# Altium project OpenCore_Carrier_Board.PrjPcb (part 1 of 2)
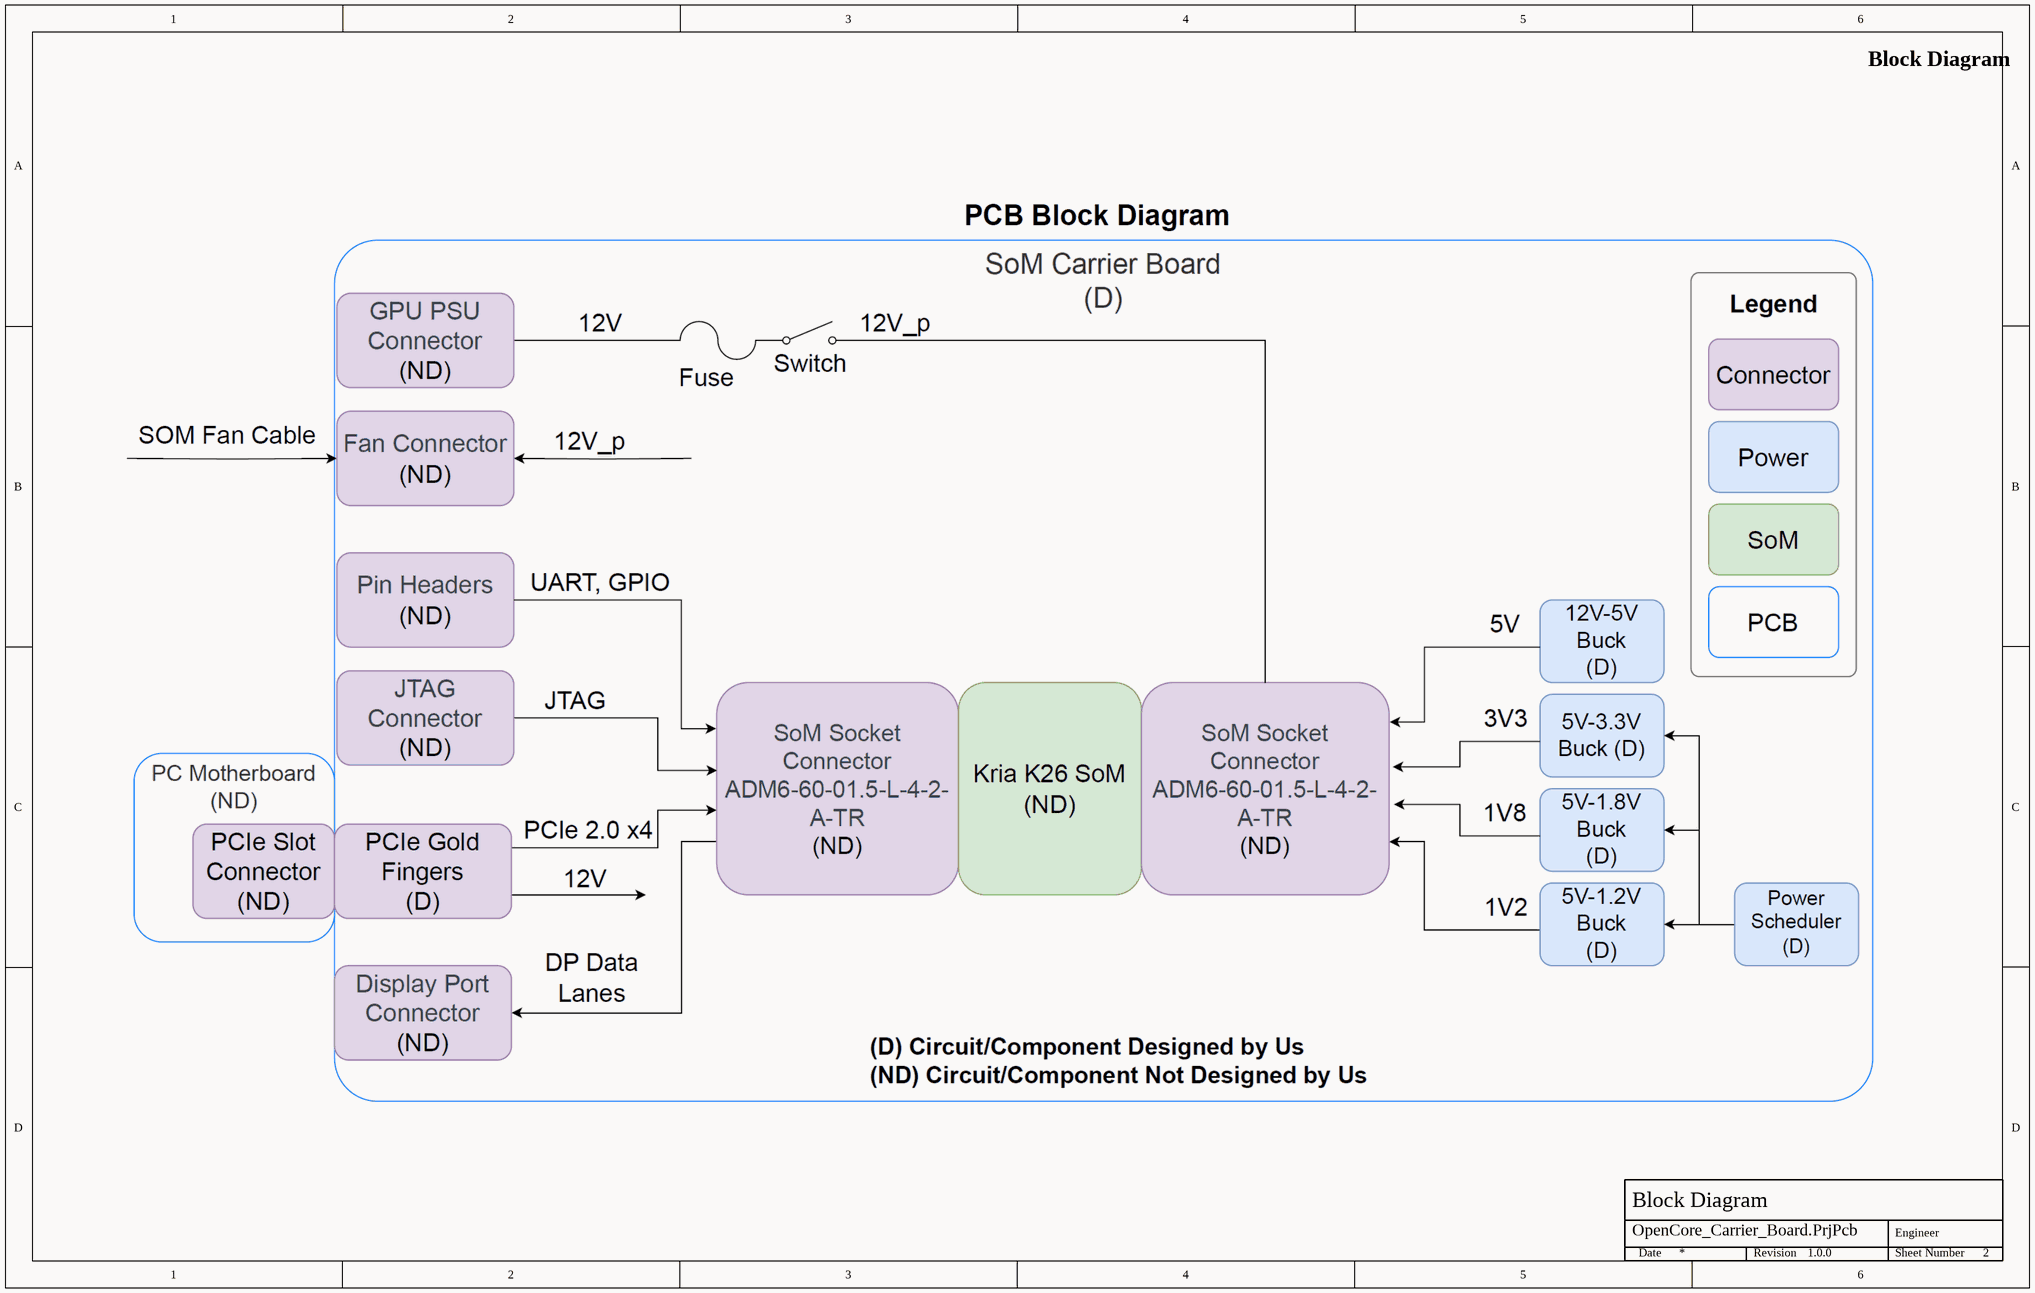
[diagram p0: S01_Block_Diagram.SchDoc]
BoardRevision: 1.0.0
12 sheets, 268 parts. Net scope: global (net labels, ports and power ports of the same name join across sheets).
Board file: OpenCore_Carrier_Board.PcbDoc
Sheets:
  S01_Block_Diagram.SchDoc
  S02_Power_Converters.SchDoc
  S03_SOM1_A_B.SchDoc
  S04_SOM1_C_D.SchDoc
  S05_SOM2_A_B.SchDoc
  S06_SOM2_C_D.SchDoc
  S07_PCIe_Connector.SchDoc
  S08_DisplayPort.SchDoc
  S09_Connectors.SchDoc
  S10_Reset_Logic.SchDoc
  S11_LEDs.SchDoc
  S12_Clocks.SchDoc

## Sheet S01_Block_Diagram.SchDoc: Block Diagram
size 381 x 241 mm; CompanyName: OpenCore; Revision: 1.0.0; SheetNumber: 2; SheetTotal: 9

### Notes on the sheet
- Engineer
- Date
- Revision
- Sheet Number

## Sheet S02_Power_Converters.SchDoc: Power Converters
size 381 x 241 mm; SheetNumber: 2; SheetTotal: 12
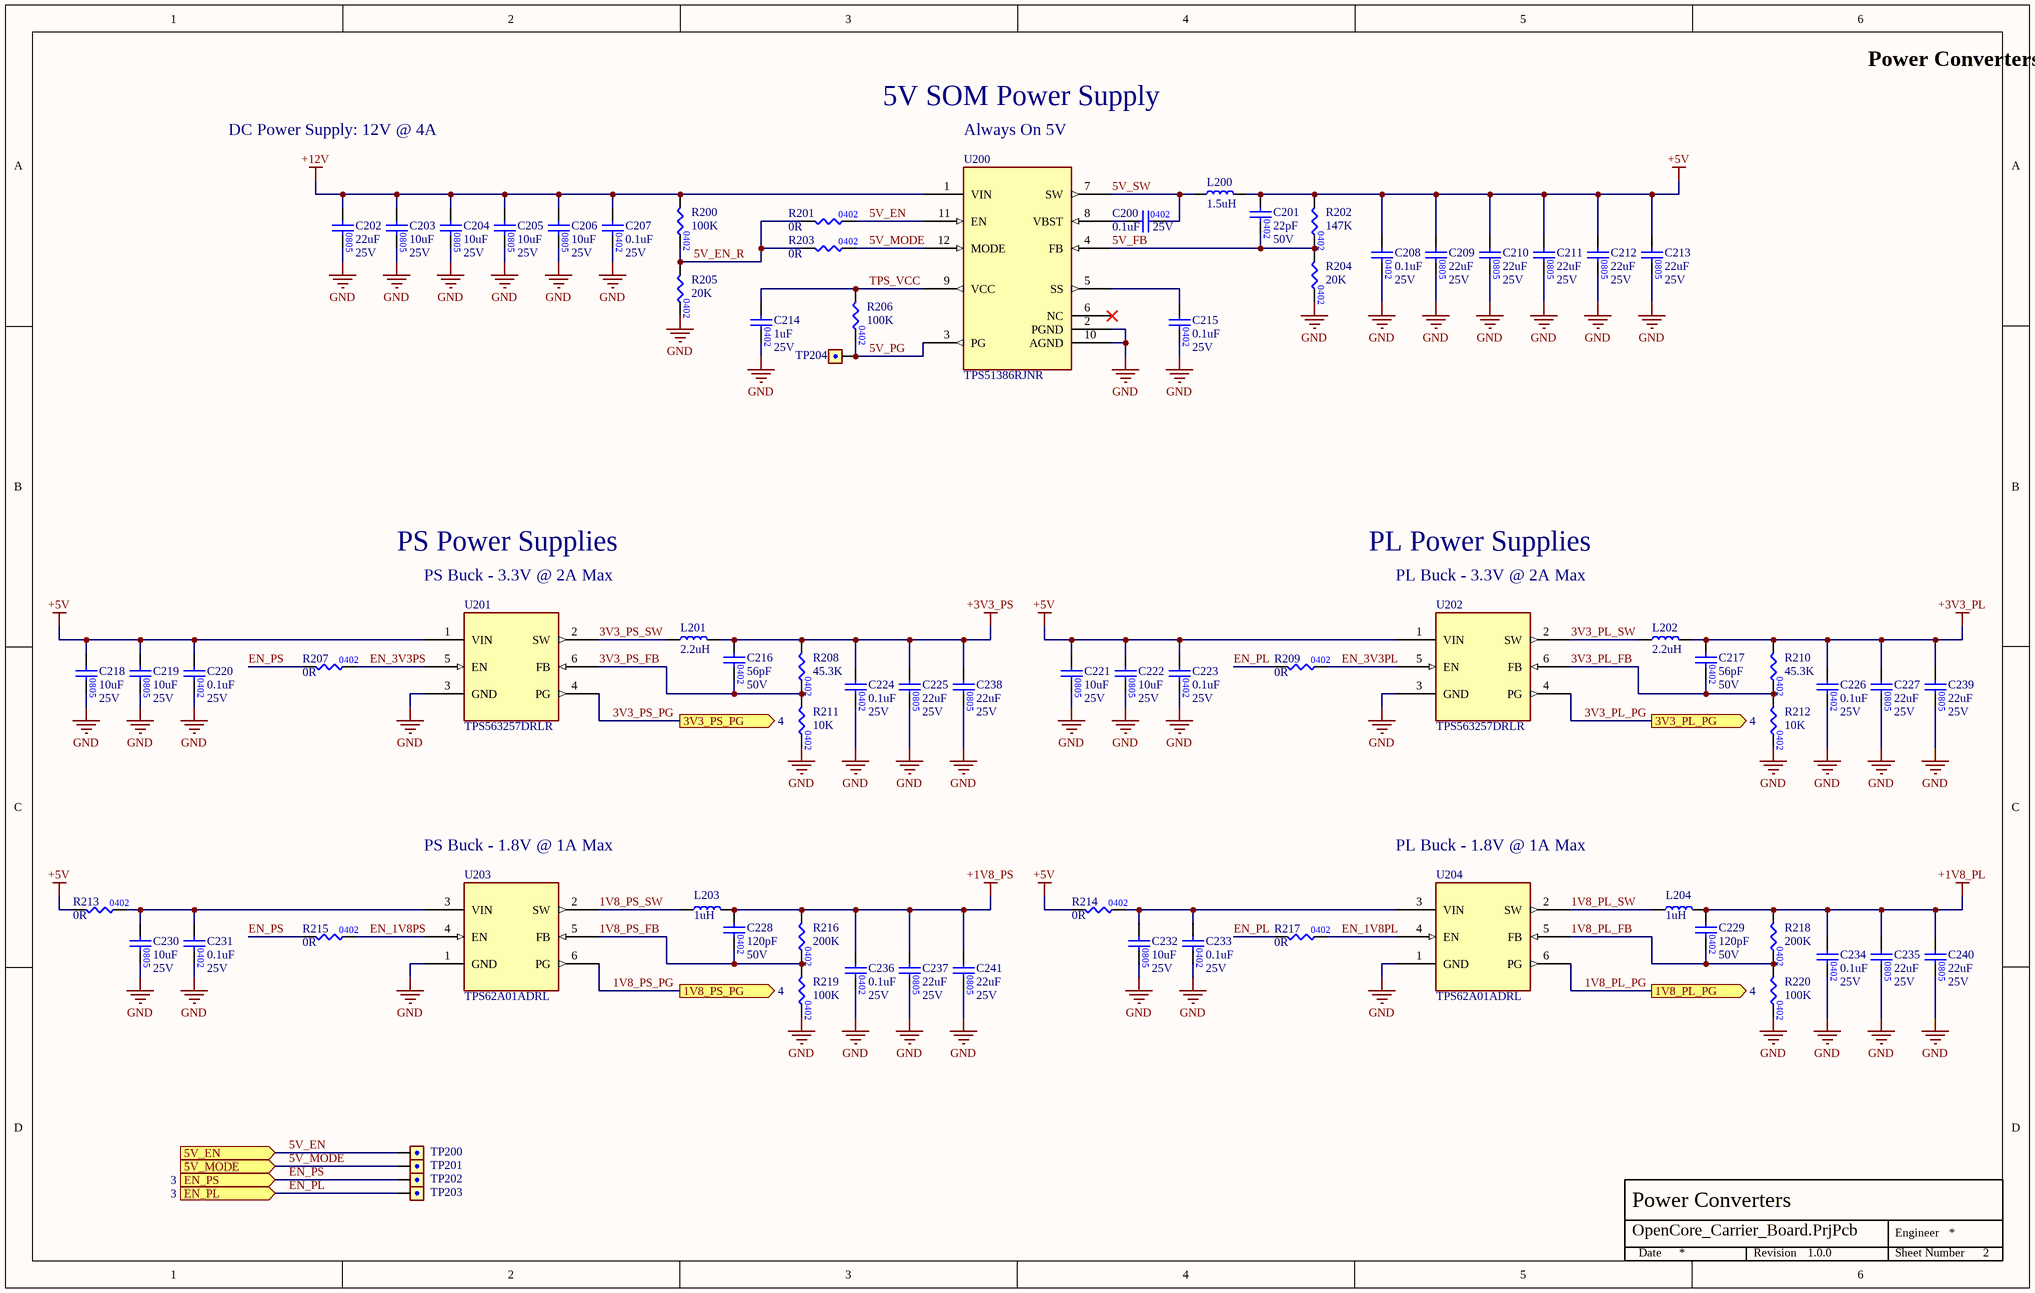
[diagram p1: S02_Power_Converters.SchDoc]

### Parts
C200  value 0.1uF  Voltage Rating: 25V  [CAP0402]  (hidden comment: CAP_0402)
C201  value 22pF  Voltage Rating: 50V  [CAP0402]  (hidden comment: CAP_0402)
C202  value 22uF  Voltage Rating: 25V  [CAP0805]  (hidden comment: CAP_0805)
C203  value 10uF  Voltage Rating: 25V  [CAP0805]  (hidden comment: CAP_0805)
C204  value 10uF  Voltage Rating: 25V  [CAP0805]  (hidden comment: CAP_0805)
C205  value 10uF  Voltage Rating: 25V  [CAP0805]  (hidden comment: CAP_0805)
C206  value 10uF  Voltage Rating: 25V  [CAP0805]  (hidden comment: CAP_0805)
C207  value 0.1uF  Voltage Rating: 25V  [CAP0402]  (hidden comment: CAP_0402)
C208  value 0.1uF  Voltage Rating: 25V  [CAP0402]  (hidden comment: CAP_0402)
C209  value 22uF  Voltage Rating: 25V  [CAP0805]  (hidden comment: CAP_0805)
C210  value 22uF  Voltage Rating: 25V  [CAP0805]  (hidden comment: CAP_0805)
C211  value 22uF  Voltage Rating: 25V  [CAP0805]  (hidden comment: CAP_0805)
C212  value 22uF  Voltage Rating: 25V  [CAP0805]  (hidden comment: CAP_0805)
C213  value 22uF  Voltage Rating: 25V  [CAP0805]  (hidden comment: CAP_0805)
C214  value 1uF  Voltage Rating: 25V  [CAP0402]  (hidden comment: CAP_0402)
C215  value 0.1uF  Voltage Rating: 25V  [CAP0402]  (hidden comment: CAP_0402)
C216  value 56pF  Voltage Rating: 50V  [CAP0402]  (hidden comment: CAP_0402)
C217  value 56pF  Voltage Rating: 50V  [CAP0402]  (hidden comment: CAP_0402)
C218  value 10uF  Voltage Rating: 25V  [CAP0805]  (hidden comment: CAP_0805)
C219  value 10uF  Voltage Rating: 25V  [CAP0805]  (hidden comment: CAP_0805)
C220  value 0.1uF  Voltage Rating: 25V  [CAP0402]  (hidden comment: CAP_0402)
C221  value 10uF  Voltage Rating: 25V  [CAP0805]  (hidden comment: CAP_0805)
C222  value 10uF  Voltage Rating: 25V  [CAP0805]  (hidden comment: CAP_0805)
C223  value 0.1uF  Voltage Rating: 25V  [CAP0402]  (hidden comment: CAP_0402)
C224  value 0.1uF  Voltage Rating: 25V  [CAP0402]  (hidden comment: CAP_0402)
C225  value 22uF  Voltage Rating: 25V  [CAP0805]  (hidden comment: CAP_0805)
C226  value 0.1uF  Voltage Rating: 25V  [CAP0402]  (hidden comment: CAP_0402)
C227  value 22uF  Voltage Rating: 25V  [CAP0805]  (hidden comment: CAP_0805)
C228  value 120pF  Voltage Rating: 50V  [CAP0402]  (hidden comment: CAP_0402)
C229  value 120pF  Voltage Rating: 50V  [CAP0402]  (hidden comment: CAP_0402)
C230  value 10uF  Voltage Rating: 25V  [CAP0805]  (hidden comment: CAP_0805)
C231  value 0.1uF  Voltage Rating: 25V  [CAP0402]  (hidden comment: CAP_0402)
C232  value 10uF  Voltage Rating: 25V  [CAP0805]  (hidden comment: CAP_0805)
C233  value 0.1uF  Voltage Rating: 25V  [CAP0402]  (hidden comment: CAP_0402)
C234  value 0.1uF  Voltage Rating: 25V  [CAP0402]  (hidden comment: CAP_0402)
C235  value 22uF  Voltage Rating: 25V  [CAP0805]  (hidden comment: CAP_0805)
C236  value 0.1uF  Voltage Rating: 25V  [CAP0402]  (hidden comment: CAP_0402)
C237  value 22uF  Voltage Rating: 25V  [CAP0805]  (hidden comment: CAP_0805)
C238  value 22uF  Voltage Rating: 25V  [CAP0805]  (hidden comment: CAP_0805)
C239  value 22uF  Voltage Rating: 25V  [CAP0805]  (hidden comment: CAP_0805)
C240  value 22uF  Voltage Rating: 25V  [CAP0805]  (hidden comment: CAP_0805)
C241  value 22uF  Voltage Rating: 25V  [CAP0805]  (hidden comment: CAP_0805)
L200  Inductance: 1.5uH  [IHLP5050CEER1R5M01]  (hidden comment: IHLP5050CEER1R5M01)
L201  Inductance: 2.2uH  [SDCHA1V6045-2R2-R]  (hidden comment: SDCHA1V6045-2R2-R)
L202  Inductance: 2.2uH  [SDCHA1V6045-2R2-R]  (hidden comment: SDCHA1V6045-2R2-R)
L203  Inductance: 1uH  [IND_2520]  (hidden comment: DFE252012F-1R0M)
L204  Inductance: 1uH  [IND_2520]  (hidden comment: DFE252012F-1R0M)
R200  Resistance: 100K  [RES0402]  (hidden comment: RES_0402)
R201  Resistance: 0R  [RES0402]  (hidden comment: RES_0402)
R202  Resistance: 147K  [RES0402]  (hidden comment: RES_0402)
R203  Resistance: 0R  [RES0402]  (hidden comment: RES_0402)
R204  Resistance: 20K  [RES0402]  (hidden comment: RES_0402)
R205  Resistance: 20K  [RES0402]  (hidden comment: RES_0402)
R206  Resistance: 100K  [RES0402]  (hidden comment: RES_0402)
R207  Resistance: 0R  [RES0402]  (hidden comment: RES_0402)
R208  Resistance: 45.3K  [RES0402]  (hidden comment: RES_0402)
R209  Resistance: 0R  [RES0402]  (hidden comment: RES_0402)
R210  Resistance: 45.3K  [RES0402]  (hidden comment: RES_0402)
R211  Resistance: 10K  [RES0402]  (hidden comment: RES_0402)
R212  Resistance: 10K  [RES0402]  (hidden comment: RES_0402)
R213  Resistance: 0R  [RES0402]  (hidden comment: RES_0402)
R214  Resistance: 0R  [RES0402]  (hidden comment: RES_0402)
R215  Resistance: 0R  [RES0402]  (hidden comment: RES_0402)
R216  Resistance: 200K  [RES0402]  (hidden comment: RES_0402)
R217  Resistance: 0R  [RES0402]  (hidden comment: RES_0402)
R218  Resistance: 200K  [RES0402]  (hidden comment: RES_0402)
R219  Resistance: 100K  [RES0402]  (hidden comment: RES_0402)
R220  Resistance: 100K  [RES0402]  (hidden comment: RES_0402)
TP200  1mm Round Pad Testpoint  [TP_1MM]  (value not drawn)
TP201  1mm Round Pad Testpoint  [TP_1MM]  (value not drawn)
TP202  1mm Round Pad Testpoint  [TP_1MM]  (value not drawn)
TP203  1mm Round Pad Testpoint  [TP_1MM]  (value not drawn)
TP204  1mm Round Pad Testpoint  [TP_1MM]  (value not drawn)
U200  TPS51386RJNR  [TI_RJN0012A_POWERVQFN12]
U201  TPS563257DRLR  [TI_SOT6_DRL0006A]
U202  TPS563257DRLR  [TI_SOT6_DRL0006A]
U203  TPS62A01ADRL  [TI_SOT6_DRL0006A]
U204  TPS62A01ADRL  [TI_SOT6_DRL0006A]

### Ports
1V8_PL_PG (out, see 4), 1V8_PS_PG (out, see 4), 3V3_PL_PG (out, see 4), 3V3_PS_PG (out, see 4), 5V_EN (in), 5V_MODE (in), EN_PL (in, see 3), EN_PS (in, see 3)

### Nets
+1V8_PL: C229.1 C234.1 C235.1 C240.1 L204.2 R218.1
+1V8_PS: C228.1 C236.1 C237.1 C241.1 L203.2 R216.1
+3V3_PL: C217.1 C226.1 C227.1 C239.1 L202.2 R210.1
+3V3_PS: C216.1 C224.1 C225.1 C238.1 L201.2 R208.1
+5V: C201.1 C208.1 C209.1 C210.1 C211.1 C212.1 C213.1 C218.1 C219.1 C220.1 C221.1 C222.1 C223.1 L200.2 R202.1 R213.1 R214.1 U201.1(VIN) U202.1(VIN)
+12V: C202.1 C203.1 C204.1 C205.1 C206.1 C207.1 R200.1 U200.1(VIN)
GND: C202.2 C203.2 C204.2 C205.2 C206.2 C207.2 C208.2 C209.2 C210.2 C211.2 C212.2 C213.2 C214.2 C215.2 C218.2 C219.2 C220.2 C221.2 C222.2 C223.2 C224.2 C225.2 C226.2 C227.2 C230.2 C231.2 C232.2 C233.2 C234.2 C235.2 C236.2 C237.2 C238.2 C239.2 C240.2 C241.2 R204.2 R205.2 R211.2 R212.2 R219.2 R220.2 U200.2(PGND) U200.10(AGND) U201.3(GND) U202.3(GND) U203.1(GND) U204.1(GND)
1V8_PL_FB: C229.2 R218.2 R220.1 U204.5(FB)
1V8_PL_PG: U204.6(PG) ; port 1V8_PL_PG
1V8_PL_SW: L204.1 U204.2(SW)
1V8_PS_FB: C228.2 R216.2 R219.1 U203.5(FB)
1V8_PS_PG: U203.6(PG) ; port 1V8_PS_PG
1V8_PS_SW: L203.1 U203.2(SW)
3V3_PL_FB: C217.2 R210.2 R212.1 U202.6(FB)
3V3_PL_PG: U202.4(PG) ; port 3V3_PL_PG
3V3_PL_SW: L202.1 U202.2(SW)
3V3_PS_FB: C216.2 R208.2 R211.1 U201.6(FB)
3V3_PS_PG: U201.4(PG) ; port 3V3_PS_PG
3V3_PS_SW: L201.1 U201.2(SW)
5V_EN: R201.2 TP200.1 U200.11(EN) ; port 5V_EN
5V_EN_R: R200.2 R201.1 R203.1 R205.1
5V_FB: C201.2 R202.2 R204.1 U200.4(FB)
5V_MODE: R203.2 TP201.1 U200.12(MODE) ; port 5V_MODE
5V_PG: R206.2 TP204.1 U200.3(PG)
5V_SW: C200.2 L200.1 U200.7(SW)
EN_1V8PL: R217.2 U204.4(EN)
EN_1V8PS: R215.2 U203.4(EN)
EN_3V3PL: R209.2 U202.5(EN)
EN_3V3PS: R207.2 U201.5(EN)
EN_PL: R209.1 R217.1 TP203.1 ; port EN_PL
EN_PS: R207.1 R215.1 TP202.1 ; port EN_PS
TPS_VCC: C214.1 R206.1 U200.9(VCC)
NetC200_1: C200.1 U200.8(VBST)
NetC215_1: C215.1 U200.5(SS)
NetC230_1: C230.1 C231.1 R213.2 U203.3(VIN)
NetC232_1: C232.1 C233.1 R214.2 U204.3(VIN)

Not connected (* = marked no-connect by the designer): U200 6(NC)*

### Notes on the sheet
- DC Power Supply: 12V @ 4A
- 5V SOM Power Supply
- Always On 5V
- PS Power Supplies
- PL Power Supplies
- PS Buck - 3.3V @ 2A Max
- PL Buck - 3.3V @ 2A Max
- PS Buck - 1.8V @ 1A Max
- PL Buck - 1.8V @ 1A Max
- Engineer
- Date
- Revision
- Sheet Number

### Library data of the parts
C200 C207 C208 C215 C220 C223 C224 C226 C231 C233 C234 C236 = CAP_CL05A104KA5NNNC: CAP CER 0.1UF 25V X5R 0402; Manufacturer: Samsung Electro-Mechanics; Tolerance: 10%; Manufacturer Part Number 1: CL05A104KA5NNNC; Case/Package: 0402; Mounting Type: Surface Mount; Temperature Coefficient: X5R
C201 = CAP_CL05C220JB51PNC: CAP CER 22PF 50V C0G/NP0 0402; Manufacturer: Samsung Electro-Mechanics; Temperature Coefficient: C0G; Tolerance: 5%; Manufacturer Part Number 1: CL05C220JB51PNC; Case/Package: 0402; Mounting Type: Surface Mount
C202 C209-C213 C225 C227 C235 C237-C241 = CAP_CL21A226MAYNNNE: CAP CER 22UF 25V X5R 0805; Manufacturer: Samsung Electro-Mechanics; Tolerance: 20%; Manufacturer Part Number 1: CL21A226MAYNNNE; Case/Package: 0805; Mounting Type: Surface Mount; Temperature Coefficient: X5R
C203-C206 C218 C219 C221 C222 C230 C232 = CAP_CL21A106KAYNNNE: CAP CER 10UF 25V X5R 0805; Manufacturer: Samsung Electro-Mechanics; Tolerance: 10%; Manufacturer Part Number 1: CL21A106KAYNNNE; Case/Package: 0805; Mounting Type: Surface Mount; Temperature Coefficient: X5R
C214 = CAP_CL10A105KA8NNNC: CAP CER 1UF 25V X5R 0603; Manufacturer: Samsung Electro-Mechanics; Tolerance: 10%; Manufacturer Part Number 1: CL10A105KA8NNNC; Case/Package: 0402; Mounting Type: Surface Mount; Temperature Coefficient: X5R
C216 C217 = CAP_CC0402JRNPO9BN560: CAP CER 56PF 50V C0G/NPO 0402; Manufacturer: YAGEO; Temperature Coefficient: C0G; Tolerance: 5%; Manufacturer Part Number 1: CC0402JRNPO9BN560; Case/Package: 0402; Mounting Type: Surface Mount
C228 C229 = CAP_CL05C121JB51PNC: CAP CER 120PF 50V C0G/NP0 0402; Manufacturer: Samsung Electro-Mechanics; Temperature Coefficient: C0G; Tolerance: 5%; Manufacturer Part Number 1: CL05C121JB51PNC; Case/Package: 0402; Mounting Type: Surface Mount
L200 = IND_IHLP5050CEER1R5M01: FIXED IND 1.5UH 19A 5.5 MOHM SMD; Manufacturer: Vishay Dale; Saturation Current: 35A; Tolerance: 20%; Case/Package: Nonstandard; Manufacturer Part Number: IHLP5050CEER1R5M01; Current Rating: 19A; DC Resistance (DCR): 5.5mOhm
L201 L202 = IND_SDCHA1V6045-2R2-R: IND SMD POWER 2.2UH 6.0A; Manufacturer: Eaton - Electronics Division; Saturation Current: 9.5A; Current Rating: 6A; DC Resistance (DCR): 15mOhm; Tolerance: 20%; Case/Package: Nonstandard; Manufacturer Part Number: SDCHA1V6045-2R2-R
L203 L204 = IND_DFE252012F-1R0M: FIXED IND 1UH 3.3A 0.04OHM SMD; Manufacturer: Murata Electronics; Saturation Current: 4.7A; DC Resistance (DCR): 40mOhm; Tolerance: 20%; Case/Package: 2520; Manufacturer Part Number: DFE252012F-1R0M; Current Rating: 3.3A
R200 R206 R219 R220 = .RES_RC0402FR-07100KL: RES 100K OHM 1% 1/16W 0402; Manufacturer: YAGEO; Manufacturer Part Number: RC0402FR-07100KL; Case/Package: 0402; Tolerance: 1%
R201 R203 R207 R209 R213-R215 R217 = .RES_RC0402JR-070RL: RES 0 OHM JUMPER 1/16W 0402; Manufacturer: YAGEO; Tolerance: 1%; Manufacturer Part Number: RC0402JR-070RL; Case/Package: 0402
R202 = .RES_RC0402FR-07147KL: RES 147K OHM 1% 1/16W 0402; Manufacturer: YAGEO; Manufacturer Part Number: RC0402FR-07147KL; Case/Package: 0402; Tolerance: 1%
R204 R205 = .RES_RC0402FR-0720KL: RES 20K OHM 1% 1/16W 0402; Manufacturer: YAGEO; Manufacturer Part Number: RC0402FR-0720KL; Case/Package: 0402; Tolerance: 1%
R208 R210 = .RES_RC0402FR-0745K3L: RES 45.3K OHM 1% 1/16W 0402; Manufacturer: YAGEO; Manufacturer Part Number: RC0402FR-0745K3L; Case/Package: 0402; Tolerance: 1%
R211 R212 = .RES_RC0402FR-0710KL: RES 10K OHM 1% 1/16W 0402; Manufacturer: YAGEO; Manufacturer Part Number: RC0402FR-0710KL; Case/Package: 0402; Tolerance: 1%
R216 R218 = .RES_RC0402FR-07200KL: RES 200K OHM 1% 1/16W 0402; Manufacturer: YAGEO; Manufacturer Part Number: RC0402FR-07200KL; Case/Package: 0402; Tolerance: 1%
TP200-TP204 = TP_1MM
U200 = TPS51386RJNR: IC REG BUCK ADJ 8A 12-PowerVFQFN; Manufacturer: Texas Instruments; Manufacturer Part Number: TPS51386RJNR
U201 U202 = TPS563257DRLR: IC REG BUCK ADJ 3A SOT563
U203 U204 = TPS62A01ADRL: IC REG BUCK ADJ 1A SOT5X3; Manufacturer: Texas Instruments; Manufacturer Part Number: TLV62568ADRLR

## Sheet S03_SOM1_A_B.SchDoc: SOM1 A & B
size 381 x 241 mm; SheetNumber: 3; SheetTotal: 12
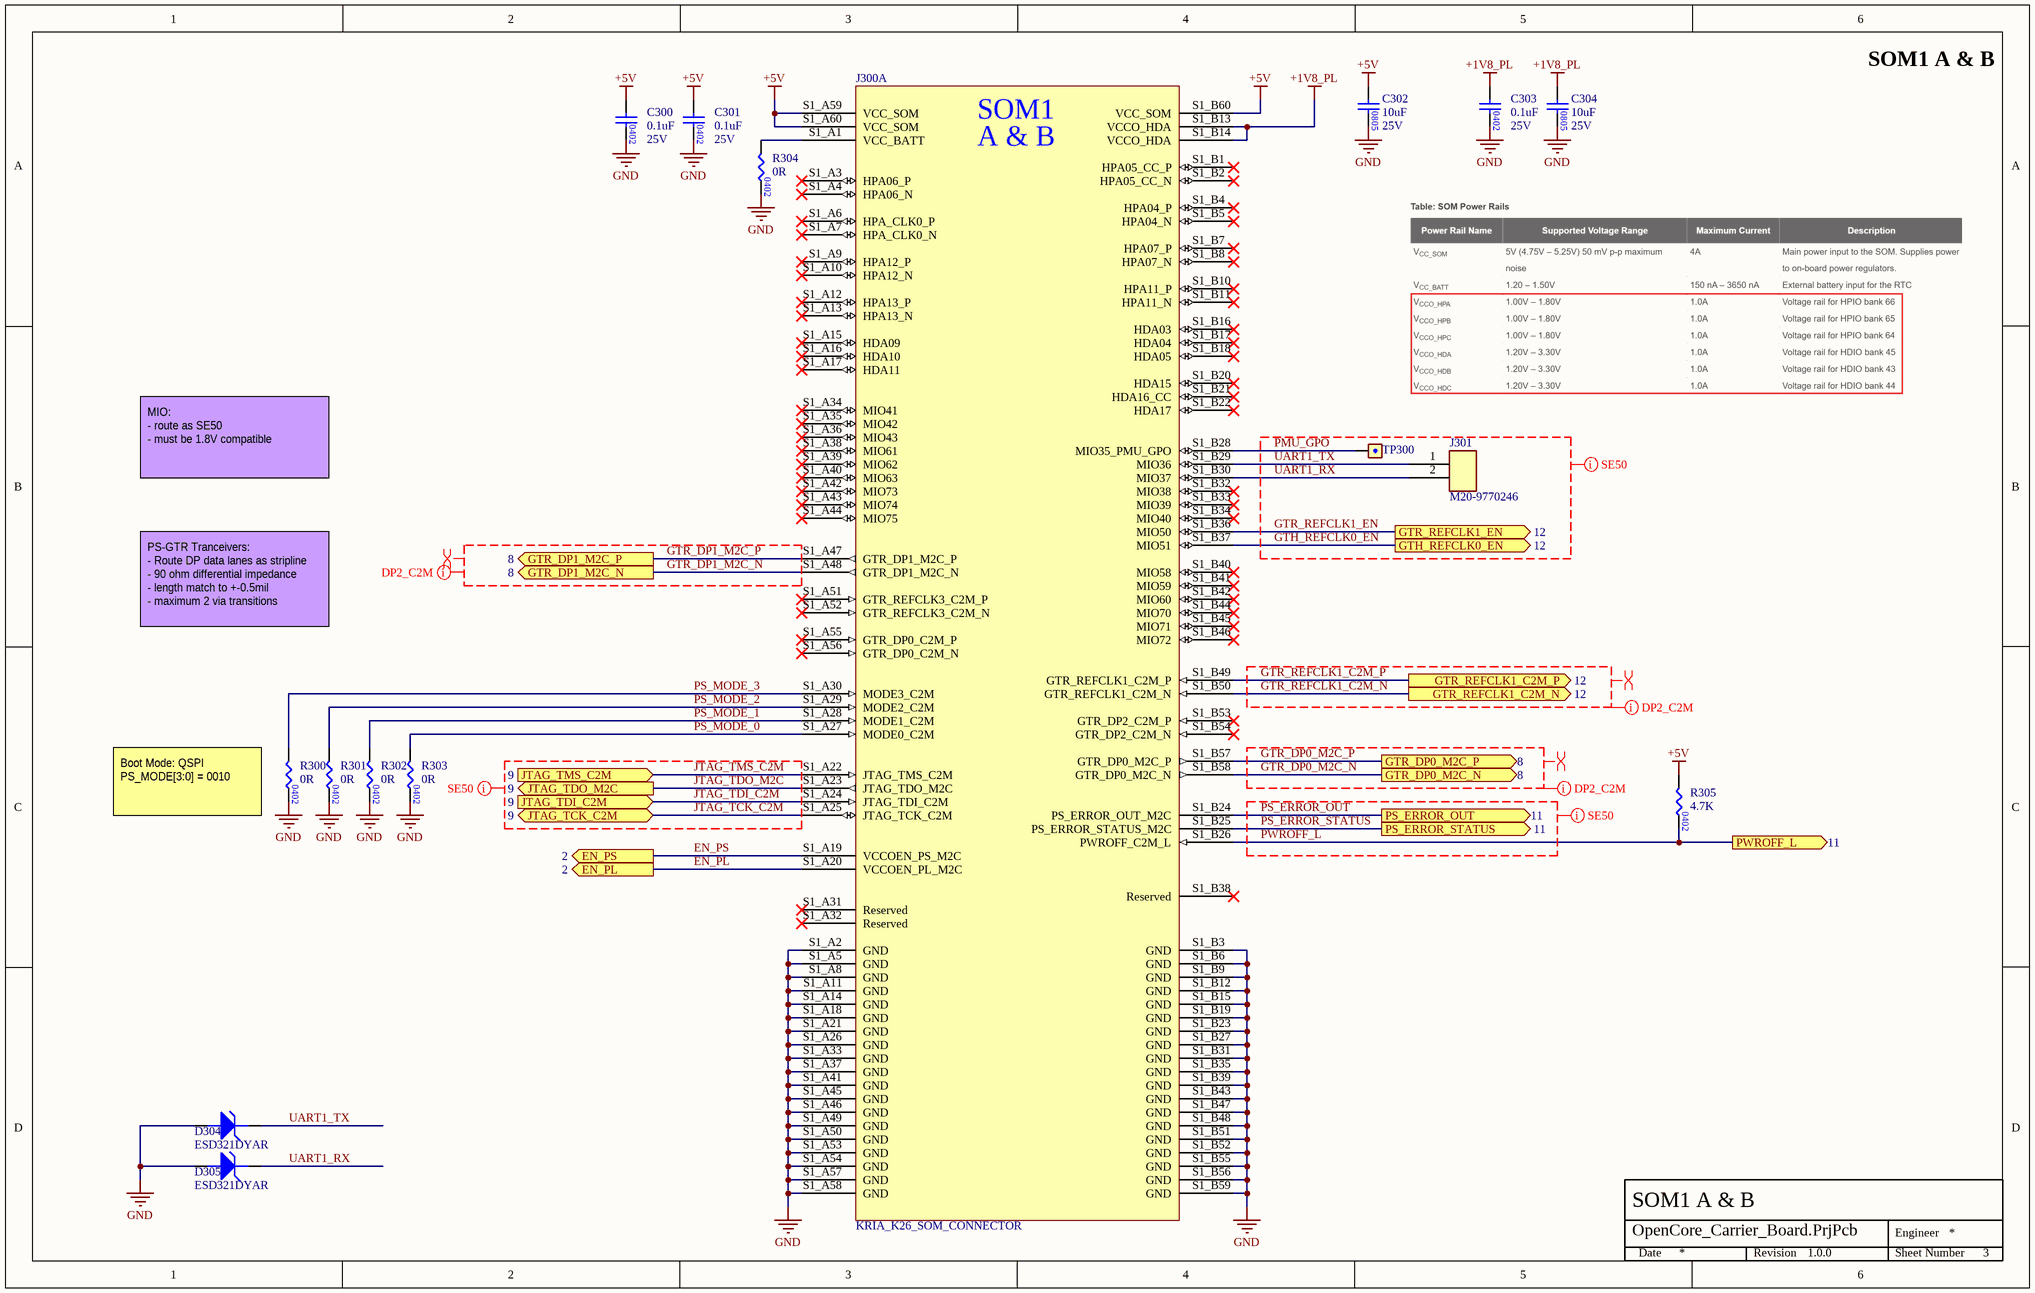
[diagram p2: S03_SOM1_A_B.SchDoc]

### Parts
C300  value 0.1uF  Voltage Rating: 25V  [CAP0402]  (hidden comment: CAP_0402)
C301  value 0.1uF  Voltage Rating: 25V  [CAP0402]  (hidden comment: CAP_0402)
C302  value 10uF  Voltage Rating: 25V  [CAP0805]  (hidden comment: CAP_0805)
C303  value 0.1uF  Voltage Rating: 25V  [CAP0402]  (hidden comment: CAP_0402)
C304  value 10uF  Voltage Rating: 25V  [CAP0805]  (hidden comment: CAP_0805)
D304  ESD321DYAR  [TI_SOD523]
D305  ESD321DYAR  [TI_SOD523]
J300  KRIA_K26_SOM_CONNECTOR  [KRIA_K26_SOM]  (part A of 4)
J301  M20-9770246  [61300211121]
R300  Resistance: 0R  [RES0402]  (hidden comment: RES_0402)
R301  Resistance: 0R  [RES0402]  (hidden comment: RES_0402)
R302  Resistance: 0R  [RES0402]  (hidden comment: RES_0402)
R303  Resistance: 0R  [RES0402]  (hidden comment: RES_0402)
R304  Resistance: 0R  [RES0402]  (hidden comment: RES_0402)
R305  Resistance: 4.7K  [RES0402]  (hidden comment: RES_0402)
TP300  1mm Round Pad Testpoint  [TP_1MM]  (value not drawn)

### Ports
EN_PL (out, see 2), EN_PS (out, see 2), GTH_REFCLK0_EN (out, see 12), GTR_DP0_M2C_N (out, see 8), GTR_DP0_M2C_P (out, see 8), GTR_DP1_M2C_N (out, see 8), GTR_DP1_M2C_P (out, see 8), GTR_REFCLK1_C2M_N (out, see 12), GTR_REFCLK1_C2M_P (out, see 12), GTR_REFCLK1_EN (out, see 12), JTAG_TCK_C2M (bidir, see 9), JTAG_TDI_C2M (in, see 9), JTAG_TDO_M2C (out, see 9), JTAG_TMS_C2M (in, see 9), PS_ERROR_OUT (out, see 11), PS_ERROR_STATUS (out, see 11), PWROFF_L (out, see 11)

### Nets
+1V8_PL: C303.1 C304.1 J300.S1_B13(VCCO_HDA) J300.S1_B14(VCCO_HDA)
+5V: C300.1 C301.1 C302.1 J300.S1_A59(VCC_SOM) J300.S1_A60(VCC_SOM) J300.S1_B60(VCC_SOM) R305.1
GND: C300.2 C301.2 C302.2 C303.2 C304.2 D304.A(Anode) D305.A(Anode) J300.S1_A2(GND) J300.S1_A5(GND) J300.S1_A8(GND) J300.S1_A11(GND) J300.S1_A14(GND) J300.S1_A18(GND) J300.S1_A21(GND) J300.S1_A26(GND) J300.S1_A33(GND) J300.S1_A37(GND) J300.S1_A41(GND) J300.S1_A45(GND) J300.S1_A46(GND) J300.S1_A49(GND) J300.S1_A50(GND) J300.S1_A53(GND) J300.S1_A54(GND) J300.S1_A57(GND) J300.S1_A58(GND) J300.S1_B3(GND) J300.S1_B6(GND) J300.S1_B9(GND) J300.S1_B12(GND) J300.S1_B15(GND) J300.S1_B19(GND) J300.S1_B23(GND) J300.S1_B27(GND) J300.S1_B31(GND) J300.S1_B35(GND) J300.S1_B39(GND) J300.S1_B43(GND) J300.S1_B47(GND) J300.S1_B48(GND) J300.S1_B51(GND) J300.S1_B52(GND) J300.S1_B55(GND) J300.S1_B56(GND) J300.S1_B59(GND) R300.2 R301.2 R302.2 R303.2 R304.2
EN_PL: J300.S1_A20(VCCOEN_PL_M2C) ; port EN_PL
EN_PS: J300.S1_A19(VCCOEN_PS_M2C) ; port EN_PS
GTH_REFCLK0_EN: J300.S1_B37(MIO51) ; port GTH_REFCLK0_EN
GTR_DP0_M2C_N: J300.S1_B58(GTR_DP0_M2C_N) ; port GTR_DP0_M2C_N
GTR_DP0_M2C_P: J300.S1_B57(GTR_DP0_M2C_P) ; port GTR_DP0_M2C_P
GTR_DP1_M2C_N: J300.S1_A48(GTR_DP1_M2C_N) ; port GTR_DP1_M2C_N
GTR_DP1_M2C_P: J300.S1_A47(GTR_DP1_M2C_P) ; port GTR_DP1_M2C_P
GTR_REFCLK1_C2M_N: J300.S1_B50(GTR_REFCLK1_C2M_N) ; port GTR_REFCLK1_C2M_N
GTR_REFCLK1_C2M_P: J300.S1_B49(GTR_REFCLK1_C2M_P) ; port GTR_REFCLK1_C2M_P
GTR_REFCLK1_EN: J300.S1_B36(MIO50) ; port GTR_REFCLK1_EN
JTAG_TCK_C2M: J300.S1_A25(JTAG_TCK_C2M) ; port JTAG_TCK_C2M
JTAG_TDI_C2M: J300.S1_A24(JTAG_TDI_C2M) ; port JTAG_TDI_C2M
JTAG_TDO_M2C: J300.S1_A23(JTAG_TDO_M2C) ; port JTAG_TDO_M2C
JTAG_TMS_C2M: J300.S1_A22(JTAG_TMS_C2M) ; port JTAG_TMS_C2M
PMU_GPO: J300.S1_B28(MIO35_PMU_GPO) TP300.1
PS_ERROR_OUT: J300.S1_B24(PS_ERROR_OUT_M2C) ; port PS_ERROR_OUT
PS_ERROR_STATUS: J300.S1_B25(PS_ERROR_STATUS_M2C) ; port PS_ERROR_STATUS
PS_MODE_0: J300.S1_A27(MODE0_C2M) R303.1
PS_MODE_1: J300.S1_A28(MODE1_C2M) R302.1
PS_MODE_2: J300.S1_A29(MODE2_C2M) R301.1
PS_MODE_3: J300.S1_A30(MODE3_C2M) R300.1
PWROFF_L: J300.S1_B26(PWROFF_C2M_L) R305.2 ; port PWROFF_L
UART1_RX: D305.K(Cathode) J300.S1_B30(MIO37) J301.2
UART1_TX: D304.K(Cathode) J300.S1_B29(MIO36) J301.1
NetJ300_S1_A1: J300.S1_A1(VCC_BATT) R304.1

Not connected (* = marked no-connect by the designer): J300 S1_A3(HPA06_P)* S1_A4(HPA06_N)* S1_A6(HPA_CLK0_P)* S1_A7(HPA_CLK0_N)* S1_A9(HPA12_P)* S1_A10(HPA12_N)* S1_A12(HPA13_P)* S1_A13(HPA13_N)* S1_A15(HDA09)* S1_A16(HDA10)* S1_A17(HDA11)* S1_A31(Reserved)* S1_A32(Reserved)* S1_A34(MIO41)* S1_A35(MIO42)* S1_A36(MIO43)* S1_A38(MIO61)* S1_A39(MIO62)* S1_A40(MIO63)* S1_A42(MIO73)* S1_A43(MIO74)* S1_A44(MIO75)* S1_A51(GTR_REFCLK3_C2M_P)* S1_A52(GTR_REFCLK3_C2M_N)* S1_A55(GTR_DP0_C2M_P)* S1_A56(GTR_DP0_C2M_N)* S1_B1(HPA05_CC_P)* S1_B2(HPA05_CC_N)* S1_B4(HPA04_P)* S1_B5(HPA04_N)* S1_B7(HPA07_P)* S1_B8(HPA07_N)* S1_B10(HPA11_P)* S1_B11(HPA11_N)* S1_B16(HDA03)* S1_B17(HDA04)* S1_B18(HDA05)* S1_B20(HDA15)* S1_B21(HDA16_CC)* S1_B22(HDA17)* S1_B32(MIO38)* S1_B33(MIO39)* S1_B34(MIO40)* S1_B38(Reserved)* S1_B40(MIO58)* S1_B41(MIO59)* S1_B42(MIO60)* S1_B44(MIO70)* S1_B45(MIO71)* S1_B46(MIO72)* S1_B53(GTR_DP2_C2M_P)* S1_B54(GTR_DP2_C2M_N)*

### Layout directives
differential pair; differential pair class DIFFPAIR90: GTR_DP0_M2C_N, GTR_DP0_M2C_P, GTR_DP1_M2C_N, GTR_DP1_M2C_P
net class DIFFPAIR_DP: GTR_DP0_M2C_N, GTR_DP0_M2C_P, GTR_DP1_M2C_N, GTR_DP1_M2C_P
net class SE50: GTH_REFCLK0_EN, GTR_REFCLK1_EN, JTAG_TCK_C2M, JTAG_TDI_C2M, JTAG_TDO_M2C, JTAG_TMS_C2M, PMU_GPO, PS_ERROR_OUT, PS_ERROR_STATUS, PWROFF_L, UART1_RX, UART1_TX
differential pair; differential pair class DIFFPAIR100: GTR_REFCLK1_C2M_N, GTR_REFCLK1_C2M_P
net class DIFFPAIR_REFCLK: GTR_REFCLK1_C2M_N, GTR_REFCLK1_C2M_P

### Notes on the sheet
- MIO:
  - route as SE50
  - must be 1.8V compatible
- PS-GTR Tranceivers:
  - Route DP data lanes as stripline
  - 90 ohm differential impedance
  - length match to +-0.5mil
  - maximum 2 via transitions
- (near R300) Boot Mode: QSPI
  PS_MODE[3:0] = 0010
- Engineer
- Date
- Revision
- Sheet Number
- (in symbol KRIA_K26_SOM, part A) SOM1; A & B

### Library data of the parts
C300 C301 C303 = CAP_CL05A104KA5NNNC: as C200 on sheet S02_Power_Converters; Manufacturer Part Number 1: CL05A104KA5NNNC; Case/Package: 0402; Mounting Type: Surface Mount; Temperature Coefficient: X5R
C302 C304 = CAP_CL21A106KAYNNNE: as C203 on sheet S02_Power_Converters; Manufacturer Part Number 1: CL21A106KAYNNNE; Case/Package: 0805; Mounting Type: Surface Mount; Temperature Coefficient: X5R
D304 D305 = ESD321DYAR: TVS DIODE 3.6VWM 6.3VC SOT5X3; Manfacturer Part Number: ESD321DYAR
J300 = KRIA_K26_SOM: 2 x 240 pos Samtec REF-226081-01; Number of Positions: 480; Manufacturer: Samtec; Manufacturer Part NUmber: REF-226081-01; Number of Rows: 8
J301 = M20-9770246: CONN HEADER VERT 2POS 2.54MM; Positions: 2; Rows: 1; Manufacturer Part Number: M20-9770246
R300-R304 = .RES_RC0402JR-070RL: as R201 on sheet S02_Power_Converters; Manufacturer Part Number: RC0402JR-070RL; Case/Package: 0402
R305 = .RES_RC0402FR-074K7L: RES 4.7K OHM 1% 1/16W 0402; Manufacturer: YAGEO; Manufacturer Part Number: RC0402FR-074K7L; Case/Package: 0402; Tolerance: 1%
TP300 = TP_1MM

## Sheet S04_SOM1_C_D.SchDoc: SOM1 C & D
size 381 x 241 mm; SheetNumber: 4; SheetTotal: 12
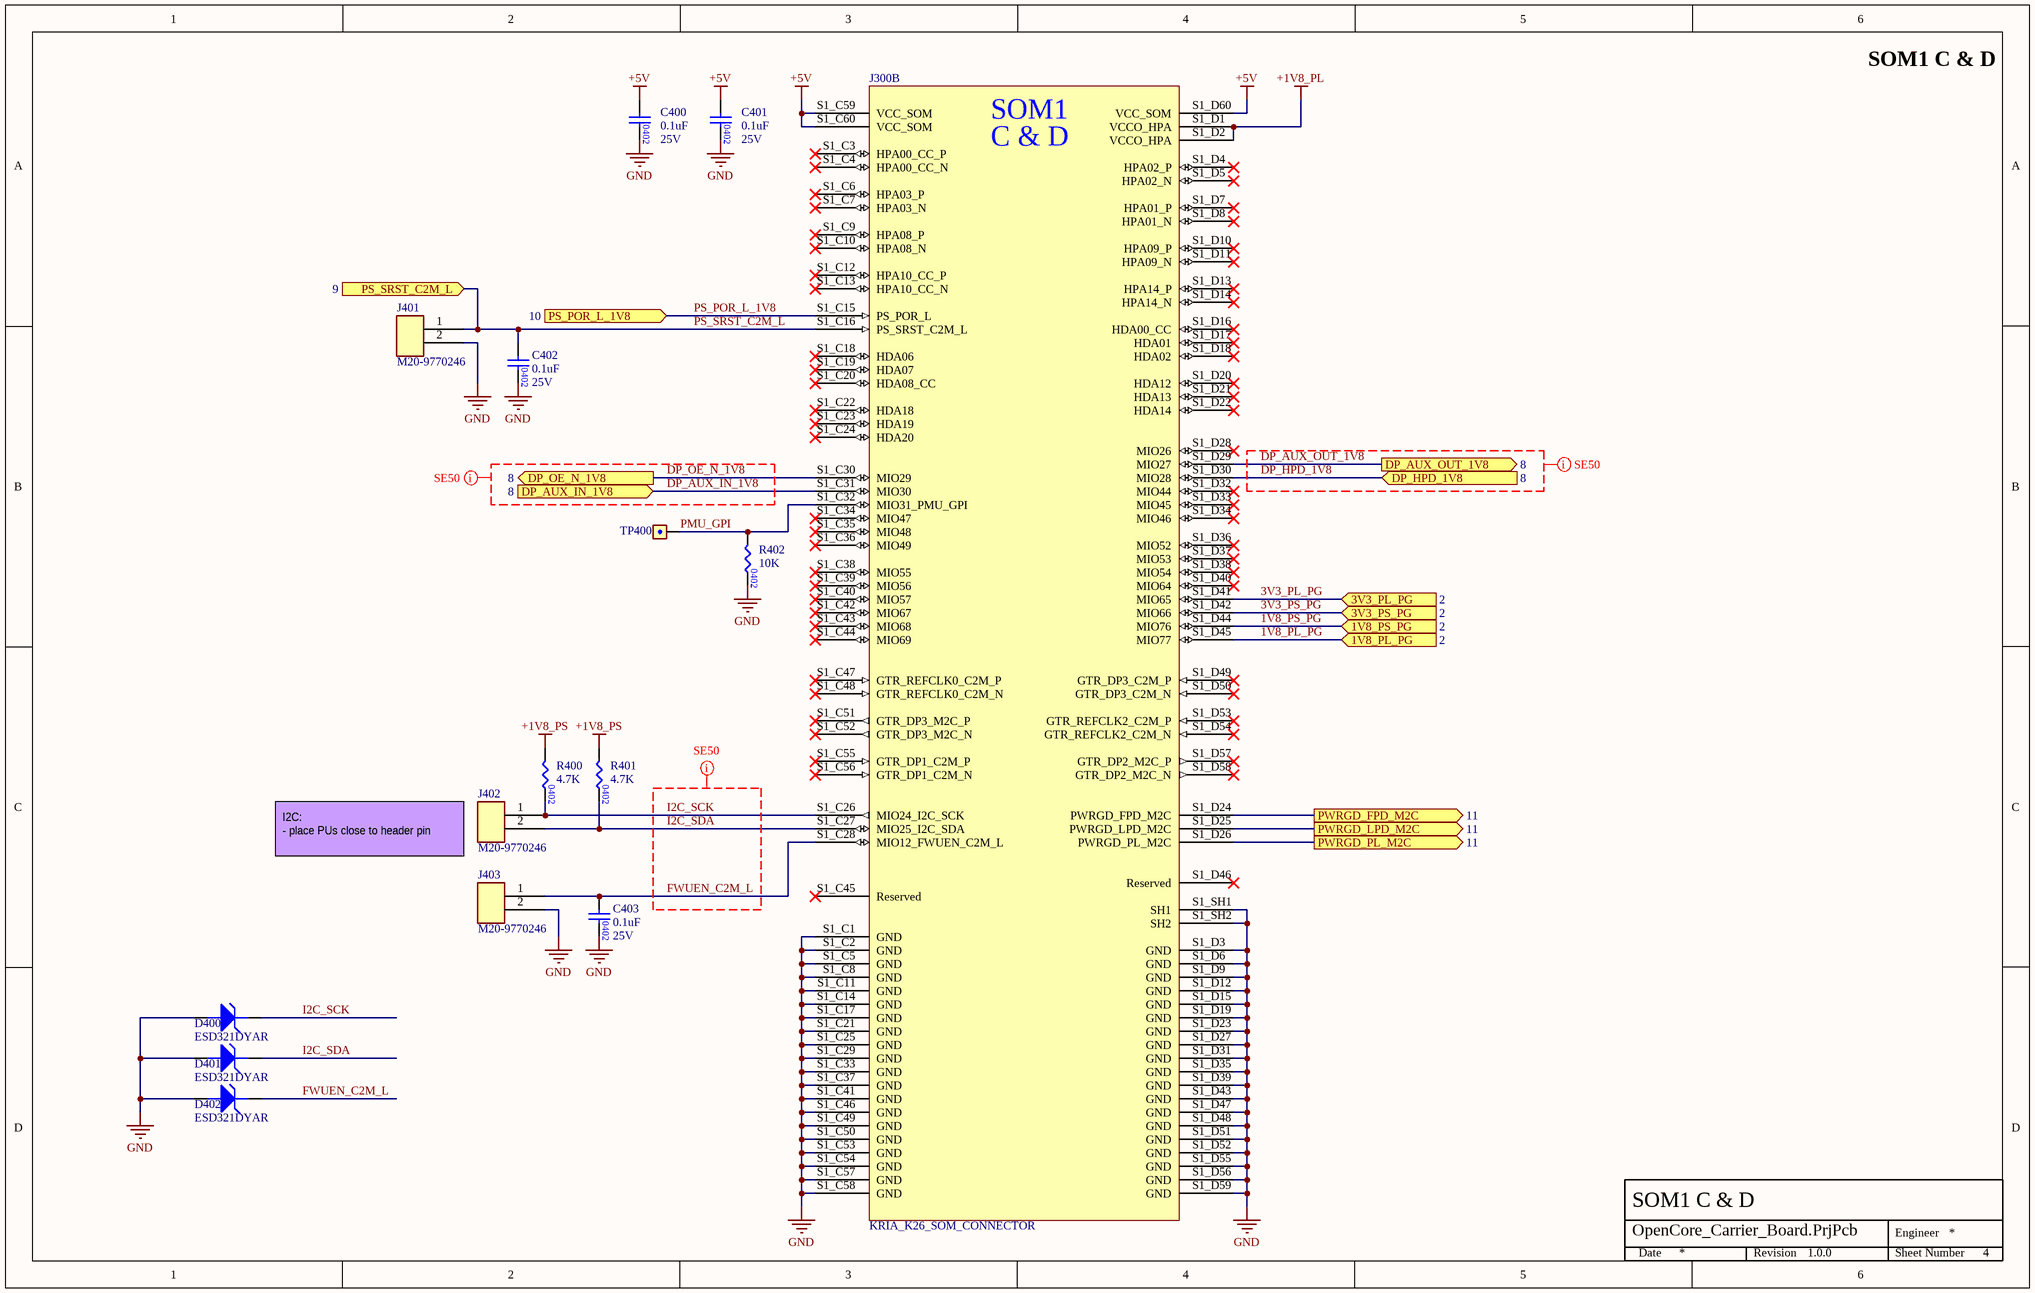
[diagram p3: S04_SOM1_C_D.SchDoc]

### Parts
C400  value 0.1uF  Voltage Rating: 25V  [CAP0402]  (hidden comment: CAP_0402)
C401  value 0.1uF  Voltage Rating: 25V  [CAP0402]  (hidden comment: CAP_0402)
C402  value 0.1uF  Voltage Rating: 25V  [CAP0402]  (hidden comment: CAP_0402)
C403  value 0.1uF  Voltage Rating: 25V  [CAP0402]  (hidden comment: CAP_0402)
D400  ESD321DYAR  [TI_SOD523]
D401  ESD321DYAR  [TI_SOD523]
D402  ESD321DYAR  [TI_SOD523]
J300  KRIA_K26_SOM_CONNECTOR  [KRIA_K26_SOM]  (part B of 4)
J401  M20-9770246  [61300211121]
J402  M20-9770246  [61300211121]
J403  M20-9770246  [61300211121]
R400  Resistance: 4.7K  [RES0402]  (hidden comment: RES_0402)
R401  Resistance: 4.7K  [RES0402]  (hidden comment: RES_0402)
R402  Resistance: 10K  [RES0402]  (hidden comment: RES_0402)
TP400  1mm Round Pad Testpoint  [TP_1MM]  (value not drawn)

### Ports
1V8_PL_PG (in, see 2), 1V8_PS_PG (in, see 2), 3V3_PL_PG (in, see 2), 3V3_PS_PG (in, see 2), DP_AUX_IN_1V8 (in, see 8), DP_AUX_OUT_1V8 (out, see 8), DP_HPD_1V8 (in, see 8), DP_OE_N_1V8 (out, see 8), PS_POR_L_1V8 (in, see 10), PS_SRST_C2M_L (in, see 9), PWRGD_FPD_M2C (out, see 11), PWRGD_LPD_M2C (out, see 11), PWRGD_PL_M2C (out, see 11)

### Nets
+1V8_PL: J300.S1_D1(VCCO_HPA) J300.S1_D2(VCCO_HPA)
+1V8_PS: R400.1 R401.1
+5V: C400.1 C401.1 J300.S1_C59(VCC_SOM) J300.S1_C60(VCC_SOM) J300.S1_D60(VCC_SOM)
GND: C400.2 C401.2 C402.2 C403.2 D400.A(Anode) D401.A(Anode) D402.A(Anode) J300.S1_C1(GND) J300.S1_C2(GND) J300.S1_C5(GND) J300.S1_C8(GND) J300.S1_C11(GND) J300.S1_C14(GND) J300.S1_C17(GND) J300.S1_C21(GND) J300.S1_C25(GND) J300.S1_C29(GND) J300.S1_C33(GND) J300.S1_C37(GND) J300.S1_C41(GND) J300.S1_C46(GND) J300.S1_C49(GND) J300.S1_C50(GND) J300.S1_C53(GND) J300.S1_C54(GND) J300.S1_C57(GND) J300.S1_C58(GND) J300.S1_D3(GND) J300.S1_D6(GND) J300.S1_D9(GND) J300.S1_D12(GND) J300.S1_D15(GND) J300.S1_D19(GND) J300.S1_D23(GND) J300.S1_D27(GND) J300.S1_D31(GND) J300.S1_D35(GND) J300.S1_D39(GND) J300.S1_D43(GND) J300.S1_D47(GND) J300.S1_D48(GND) J300.S1_D51(GND) J300.S1_D52(GND) J300.S1_D55(GND) J300.S1_D56(GND) J300.S1_D59(GND) J300.S1_SH1(SH1) J300.S1_SH2(SH2) J401.2 J403.2 R402.2
1V8_PL_PG: J300.S1_D45(MIO77) ; port 1V8_PL_PG
1V8_PS_PG: J300.S1_D44(MIO76) ; port 1V8_PS_PG
3V3_PL_PG: J300.S1_D41(MIO65) ; port 3V3_PL_PG
3V3_PS_PG: J300.S1_D42(MIO66) ; port 3V3_PS_PG
DP_AUX_IN_1V8: J300.S1_C31(MIO30) ; port DP_AUX_IN_1V8
DP_AUX_OUT_1V8: J300.S1_D29(MIO27) ; port DP_AUX_OUT_1V8
DP_HPD_1V8: J300.S1_D30(MIO28) ; port DP_HPD_1V8
DP_OE_N_1V8: J300.S1_C30(MIO29) ; port DP_OE_N_1V8
FWUEN_C2M_L: C403.1 D402.K(Cathode) J300.S1_C28(MIO12_FWUEN_C2M_L) J403.1
I2C_SCK: D400.K(Cathode) J300.S1_C26(MIO24_I2C_SCK) J402.1 R400.2
I2C_SDA: D401.K(Cathode) J300.S1_C27(MIO25_I2C_SDA) J402.2 R401.2
PMU_GPI: J300.S1_C32(MIO31_PMU_GPI) R402.1 TP400.1
PS_POR_L_1V8: J300.S1_C15(PS_POR_L) ; port PS_POR_L_1V8
PS_SRST_C2M_L: C402.1 J300.S1_C16(PS_SRST_C2M_L) J401.1 ; port PS_SRST_C2M_L
NetJ300_S1_D24: J300.S1_D24(PWRGD_FPD_M2C) ; port PWRGD_FPD_M2C
NetJ300_S1_D25: J300.S1_D25(PWRGD_LPD_M2C) ; port PWRGD_LPD_M2C
NetJ300_S1_D26: J300.S1_D26(PWRGD_PL_M2C) ; port PWRGD_PL_M2C

Not connected (* = marked no-connect by the designer): J300 S1_C3(HPA00_CC_P)* S1_C4(HPA00_CC_N)* S1_C6(HPA03_P)* S1_C7(HPA03_N)* S1_C9(HPA08_P)* S1_C10(HPA08_N)* S1_C12(HPA10_CC_P)* S1_C13(HPA10_CC_N)* S1_C18(HDA06)* S1_C19(HDA07)* S1_C20(HDA08_CC)* S1_C22(HDA18)* S1_C23(HDA19)* S1_C24(HDA20)* S1_C34(MIO47)* S1_C35(MIO48)* S1_C36(MIO49)* S1_C38(MIO55)* S1_C39(MIO56)* S1_C40(MIO57)* S1_C42(MIO67)* S1_C43(MIO68)* S1_C44(MIO69)* S1_C45(Reserved)* S1_C47(GTR_REFCLK0_C2M_P)* S1_C48(GTR_REFCLK0_C2M_N)* S1_C51(GTR_DP3_M2C_P)* S1_C52(GTR_DP3_M2C_N)* S1_C55(GTR_DP1_C2M_P)* S1_C56(GTR_DP1_C2M_N)* S1_D4(HPA02_P)* S1_D5(HPA02_N)* S1_D7(HPA01_P)* S1_D8(HPA01_N)* S1_D10(HPA09_P)* S1_D11(HPA09_N)* S1_D13(HPA14_P)* S1_D14(HPA14_N)* S1_D16(HDA00_CC)* S1_D17(HDA01)* S1_D18(HDA02)* S1_D20(HDA12)* S1_D21(HDA13)* S1_D22(HDA14)* S1_D28(MIO26)* S1_D32(MIO44)* S1_D33(MIO45)* S1_D34(MIO46)* S1_D36(MIO52)* S1_D37(MIO53)* S1_D38(MIO54)* S1_D40(MIO64)* S1_D46(Reserved)* S1_D49(GTR_DP3_C2M_P)* S1_D50(GTR_DP3_C2M_N)* S1_D53(GTR_REFCLK2_C2M_P)* S1_D54(GTR_REFCLK2_C2M_N)* S1_D57(GTR_DP2_M2C_P)* S1_D58(GTR_DP2_M2C_N)*

### Layout directives
net class SE50: DP_AUX_IN_1V8, DP_AUX_OUT_1V8, DP_HPD_1V8, DP_OE_N_1V8, FWUEN_C2M_L, I2C_SCK, I2C_SDA

### Notes on the sheet
- I2C:
  - place PUs close to header pin
- Engineer
- Date
- Revision
- Sheet Number
- (in symbol KRIA_K26_SOM, part B) SOM1; C & D

### Library data of the parts
C400-C403 = CAP_CL05A104KA5NNNC: as C200 on sheet S02_Power_Converters; Manufacturer Part Number 1: CL05A104KA5NNNC; Case/Package: 0402; Mounting Type: Surface Mount; Temperature Coefficient: X5R
D400-D402 = ESD321DYAR: TVS DIODE 3.6VWM 6.3VC SOT5X3; Manfacturer Part Number: ESD321DYAR
J300 = KRIA_K26_SOM: as J300 on sheet S03_SOM1_A_B; Manufacturer: Samtec; Manufacturer Part NUmber: REF-226081-01; Number of Rows: 8
J401-J403 = M20-9770246: as J301 on sheet S03_SOM1_A_B; Manufacturer Part Number: M20-9770246
R400 R401 = .RES_RC0402FR-074K7L: as R305 on sheet S03_SOM1_A_B; Manufacturer Part Number: RC0402FR-074K7L; Case/Package: 0402; Tolerance: 1%
R402 = .RES_RC0402FR-0710KL: as R211 on sheet S02_Power_Converters; Manufacturer Part Number: RC0402FR-0710KL; Case/Package: 0402; Tolerance: 1%
TP400 = TP_1MM

## Sheet S05_SOM2_A_B.SchDoc: SOM2 A & B
size 381 x 241 mm; SheetNumber: 5; SheetTotal: 12
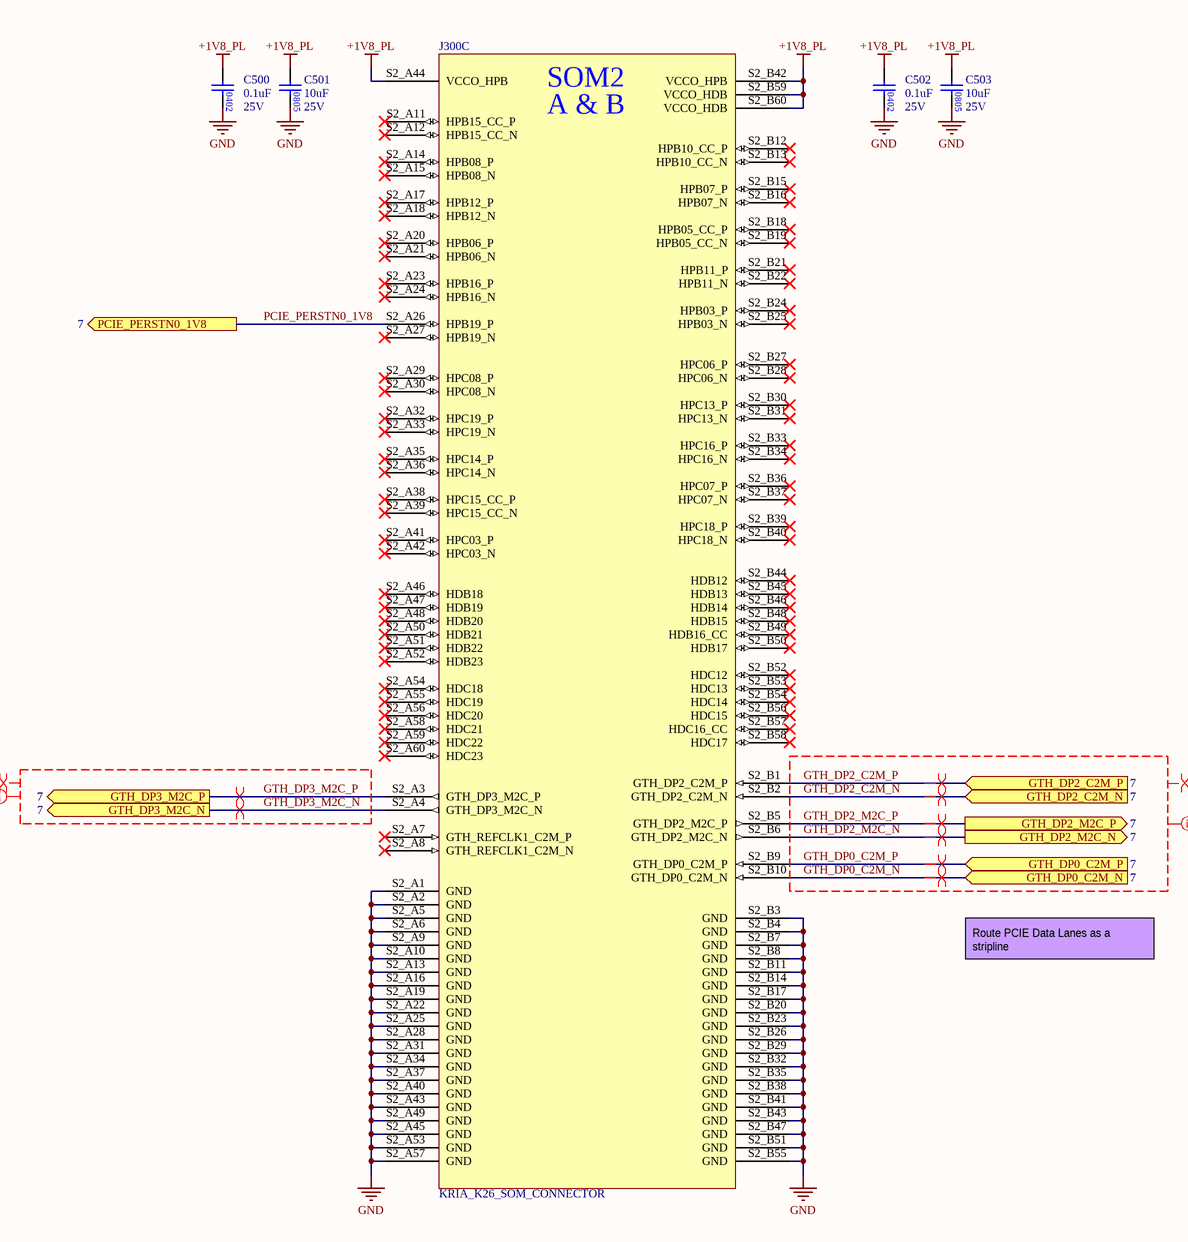
[diagram p4: S05_SOM2_A_B.SchDoc]

### Parts
C500  value 0.1uF  Voltage Rating: 25V  [CAP0402]  (hidden comment: CAP_0402)
C501  value 10uF  Voltage Rating: 25V  [CAP0805]  (hidden comment: CAP_0805)
C502  value 0.1uF  Voltage Rating: 25V  [CAP0402]  (hidden comment: CAP_0402)
C503  value 10uF  Voltage Rating: 25V  [CAP0805]  (hidden comment: CAP_0805)
J300  KRIA_K26_SOM_CONNECTOR  [KRIA_K26_SOM]  (part C of 4)

### Ports
GTH_DP0_C2M_N (in, see 7), GTH_DP0_C2M_P (in, see 7), GTH_DP2_C2M_N (in, see 7), GTH_DP2_C2M_P (in, see 7), GTH_DP2_M2C_N (out, see 7), GTH_DP2_M2C_P (out, see 7), GTH_DP3_M2C_N (out, see 7), GTH_DP3_M2C_P (out, see 7), PCIE_PERSTN0_1V8 (out, see 7)

### Nets
+1V8_PL: C500.1 C501.1 C502.1 C503.1 J300.S2_A44(VCCO_HPB) J300.S2_B42(VCCO_HPB) J300.S2_B59(VCCO_HDB) J300.S2_B60(VCCO_HDB)
GND: C500.2 C501.2 C502.2 C503.2 J300.S2_A1(GND) J300.S2_A2(GND) J300.S2_A5(GND) J300.S2_A6(GND) J300.S2_A9(GND) J300.S2_A10(GND) J300.S2_A13(GND) J300.S2_A16(GND) J300.S2_A19(GND) J300.S2_A22(GND) J300.S2_A25(GND) J300.S2_A28(GND) J300.S2_A31(GND) J300.S2_A34(GND) J300.S2_A37(GND) J300.S2_A40(GND) J300.S2_A43(GND) J300.S2_A45(GND) J300.S2_A49(GND) J300.S2_A53(GND) J300.S2_A57(GND) J300.S2_B3(GND) J300.S2_B4(GND) J300.S2_B7(GND) J300.S2_B8(GND) J300.S2_B11(GND) J300.S2_B14(GND) J300.S2_B17(GND) J300.S2_B20(GND) J300.S2_B23(GND) J300.S2_B26(GND) J300.S2_B29(GND) J300.S2_B32(GND) J300.S2_B35(GND) J300.S2_B38(GND) J300.S2_B41(GND) J300.S2_B43(GND) J300.S2_B47(GND) J300.S2_B51(GND) J300.S2_B55(GND)
GTH_DP0_C2M_N: J300.S2_B10(GTH_DP0_C2M_N) ; port GTH_DP0_C2M_N
GTH_DP0_C2M_P: J300.S2_B9(GTH_DP0_C2M_P) ; port GTH_DP0_C2M_P
GTH_DP2_C2M_N: J300.S2_B2(GTH_DP2_C2M_N) ; port GTH_DP2_C2M_N
GTH_DP2_C2M_P: J300.S2_B1(GTH_DP2_C2M_P) ; port GTH_DP2_C2M_P
GTH_DP2_M2C_N: J300.S2_B6(GTH_DP2_M2C_N) ; port GTH_DP2_M2C_N
GTH_DP2_M2C_P: J300.S2_B5(GTH_DP2_M2C_P) ; port GTH_DP2_M2C_P
GTH_DP3_M2C_N: J300.S2_A4(GTH_DP3_M2C_N) ; port GTH_DP3_M2C_N
GTH_DP3_M2C_P: J300.S2_A3(GTH_DP3_M2C_P) ; port GTH_DP3_M2C_P
PCIE_PERSTN0_1V8: J300.S2_A26(HPB19_P) ; port PCIE_PERSTN0_1V8

Not connected (* = marked no-connect by the designer): J300 S2_A7(GTH_REFCLK1_C2M_P)* S2_A8(GTH_REFCLK1_C2M_N)* S2_A11(HPB15_CC_P)* S2_A12(HPB15_CC_N)* S2_A14(HPB08_P)* S2_A15(HPB08_N)* S2_A17(HPB12_P)* S2_A18(HPB12_N)* S2_A20(HPB06_P)* S2_A21(HPB06_N)* S2_A23(HPB16_P)* S2_A24(HPB16_N)* S2_A27(HPB19_N)* S2_A29(HPC08_P)* S2_A30(HPC08_N)* S2_A32(HPC19_P)* S2_A33(HPC19_N)* S2_A35(HPC14_P)* S2_A36(HPC14_N)* S2_A38(HPC15_CC_P)* S2_A39(HPC15_CC_N)* S2_A41(HPC03_P)* S2_A42(HPC03_N)* S2_A46(HDB18)* S2_A47(HDB19)* S2_A48(HDB20)* S2_A50(HDB21)* S2_A51(HDB22)* S2_A52(HDB23)* S2_A54(HDC18)* S2_A55(HDC19)* S2_A56(HDC20)* S2_A58(HDC21)* S2_A59(HDC22)* S2_A60(HDC23)* S2_B12(HPB10_CC_P)* S2_B13(HPB10_CC_N)* S2_B15(HPB07_P)* S2_B16(HPB07_N)* S2_B18(HPB05_CC_P)* S2_B19(HPB05_CC_N)* S2_B21(HPB11_P)* S2_B22(HPB11_N)* S2_B24(HPB03_P)* S2_B25(HPB03_N)* S2_B27(HPC06_P)* S2_B28(HPC06_N)* S2_B30(HPC13_P)* S2_B31(HPC13_N)* S2_B33(HPC16_P)* S2_B34(HPC16_N)* S2_B36(HPC07_P)* S2_B37(HPC07_N)* S2_B39(HPC18_P)* S2_B40(HPC18_N)* S2_B44(HDB12)* S2_B45(HDB13)* S2_B46(HDB14)* S2_B48(HDB15)* S2_B49(HDB16_CC)* S2_B50(HDB17)* S2_B52(HDC12)* S2_B53(HDC13)* S2_B54(HDC14)* S2_B56(HDC15)* S2_B57(HDC16_CC)* S2_B58(HDC17)*

### Layout directives
differential pair: GTH_DP0_C2M_N, GTH_DP0_C2M_P, GTH_DP2_C2M_N, GTH_DP2_C2M_P, GTH_DP2_M2C_N, GTH_DP2_M2C_P, GTH_DP3_M2C_N, GTH_DP3_M2C_P
differential pair; differential pair class DIFFPAIR90: GTH_DP0_C2M_N, GTH_DP0_C2M_P, GTH_DP2_C2M_N, GTH_DP2_C2M_P, GTH_DP2_M2C_N, GTH_DP2_M2C_P, GTH_DP3_M2C_N, GTH_DP3_M2C_P
net class DIFFPAIR_GTH: GTH_DP0_C2M_N, GTH_DP0_C2M_P, GTH_DP2_C2M_N, GTH_DP2_C2M_P, GTH_DP2_M2C_N, GTH_DP2_M2C_P, GTH_DP3_M2C_N, GTH_DP3_M2C_P

### Notes on the sheet
- Route PCIE Data Lanes as a stripline
- Engineer
- Date
- Revision
- Sheet Number
- (in symbol KRIA_K26_SOM, part C) SOM2; A & B

### Library data of the parts
C500 C502 = CAP_CL05A104KA5NNNC: as C200 on sheet S02_Power_Converters; Manufacturer Part Number 1: CL05A104KA5NNNC; Case/Package: 0402; Mounting Type: Surface Mount; Temperature Coefficient: X5R
C501 C503 = CAP_CL21A106KAYNNNE: as C203 on sheet S02_Power_Converters; Manufacturer Part Number 1: CL21A106KAYNNNE; Case/Package: 0805; Mounting Type: Surface Mount; Temperature Coefficient: X5R
J300 = KRIA_K26_SOM: as J300 on sheet S03_SOM1_A_B; Manufacturer: Samtec; Manufacturer Part NUmber: REF-226081-01; Number of Rows: 8

## Sheet S06_SOM2_C_D.SchDoc: SOM2 C & D
size 381 x 241 mm; SheetNumber: 6; SheetTotal: 12
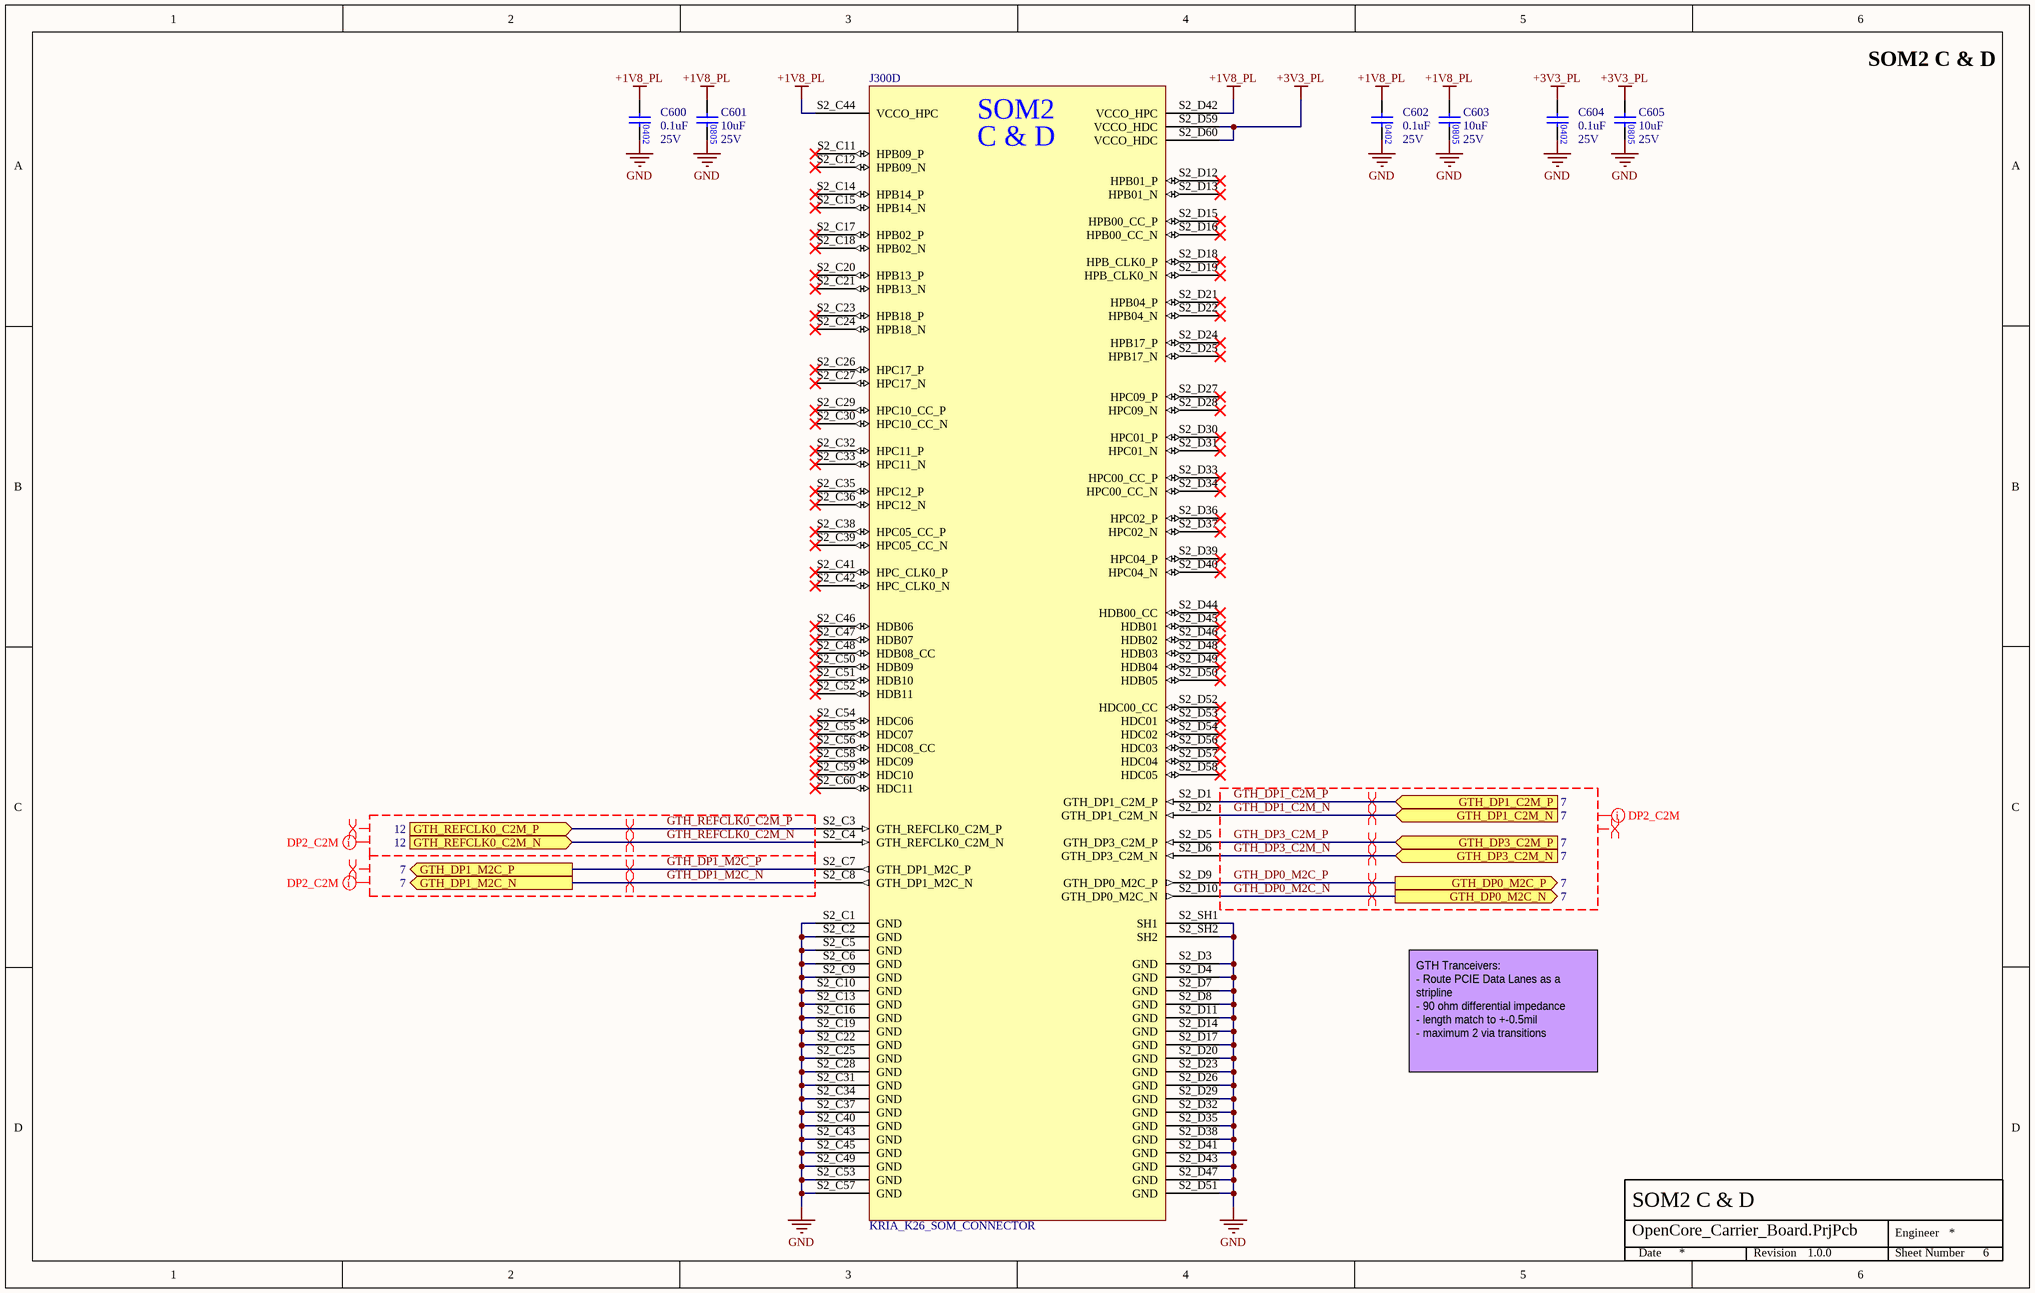
[diagram p5: S06_SOM2_C_D.SchDoc]

### Parts
C600  value 0.1uF  Voltage Rating: 25V  [CAP0402]  (hidden comment: CAP_0402)
C601  value 10uF  Voltage Rating: 25V  [CAP0805]  (hidden comment: CAP_0805)
C602  value 0.1uF  Voltage Rating: 25V  [CAP0402]  (hidden comment: CAP_0402)
C603  value 10uF  Voltage Rating: 25V  [CAP0805]  (hidden comment: CAP_0805)
C604  value 0.1uF  Voltage Rating: 25V  [CAP0402]  (hidden comment: CAP_0402)
C605  value 10uF  Voltage Rating: 25V  [CAP0805]  (hidden comment: CAP_0805)
J300  KRIA_K26_SOM_CONNECTOR  [KRIA_K26_SOM]  (part D of 4)

### Ports
GTH_DP0_M2C_N (out, see 7), GTH_DP0_M2C_P (out, see 7), GTH_DP1_C2M_N (in, see 7), GTH_DP1_C2M_P (in, see 7), GTH_DP1_M2C_N (out, see 7), GTH_DP1_M2C_P (out, see 7), GTH_DP3_C2M_N (in, see 7), GTH_DP3_C2M_P (in, see 7), GTH_REFCLK0_C2M_N (in, see 12), GTH_REFCLK0_C2M_P (in, see 12)

### Nets
+1V8_PL: C600.1 C601.1 C602.1 C603.1 J300.S2_C44(VCCO_HPC) J300.S2_D42(VCCO_HPC)
+3V3_PL: C604.1 C605.1 J300.S2_D59(VCCO_HDC) J300.S2_D60(VCCO_HDC)
GND: C600.2 C601.2 C602.2 C603.2 C604.2 C605.2 J300.S2_C1(GND) J300.S2_C2(GND) J300.S2_C5(GND) J300.S2_C6(GND) J300.S2_C9(GND) J300.S2_C10(GND) J300.S2_C13(GND) J300.S2_C16(GND) J300.S2_C19(GND) J300.S2_C22(GND) J300.S2_C25(GND) J300.S2_C28(GND) J300.S2_C31(GND) J300.S2_C34(GND) J300.S2_C37(GND) J300.S2_C40(GND) J300.S2_C43(GND) J300.S2_C45(GND) J300.S2_C49(GND) J300.S2_C53(GND) J300.S2_C57(GND) J300.S2_D3(GND) J300.S2_D4(GND) J300.S2_D7(GND) J300.S2_D8(GND) J300.S2_D11(GND) J300.S2_D14(GND) J300.S2_D17(GND) J300.S2_D20(GND) J300.S2_D23(GND) J300.S2_D26(GND) J300.S2_D29(GND) J300.S2_D32(GND) J300.S2_D35(GND) J300.S2_D38(GND) J300.S2_D41(GND) J300.S2_D43(GND) J300.S2_D47(GND) J300.S2_D51(GND) J300.S2_SH1(SH1) J300.S2_SH2(SH2)
GTH_DP0_M2C_N: J300.S2_D10(GTH_DP0_M2C_N) ; port GTH_DP0_M2C_N
GTH_DP0_M2C_P: J300.S2_D9(GTH_DP0_M2C_P) ; port GTH_DP0_M2C_P
GTH_DP1_C2M_N: J300.S2_D2(GTH_DP1_C2M_N) ; port GTH_DP1_C2M_N
GTH_DP1_C2M_P: J300.S2_D1(GTH_DP1_C2M_P) ; port GTH_DP1_C2M_P
GTH_DP1_M2C_N: J300.S2_C8(GTH_DP1_M2C_N) ; port GTH_DP1_M2C_N
GTH_DP1_M2C_P: J300.S2_C7(GTH_DP1_M2C_P) ; port GTH_DP1_M2C_P
GTH_DP3_C2M_N: J300.S2_D6(GTH_DP3_C2M_N) ; port GTH_DP3_C2M_N
GTH_DP3_C2M_P: J300.S2_D5(GTH_DP3_C2M_P) ; port GTH_DP3_C2M_P
GTH_REFCLK0_C2M_N: J300.S2_C4(GTH_REFCLK0_C2M_N) ; port GTH_REFCLK0_C2M_N
GTH_REFCLK0_C2M_P: J300.S2_C3(GTH_REFCLK0_C2M_P) ; port GTH_REFCLK0_C2M_P

Not connected (* = marked no-connect by the designer): J300 S2_C11(HPB09_P)* S2_C12(HPB09_N)* S2_C14(HPB14_P)* S2_C15(HPB14_N)* S2_C17(HPB02_P)* S2_C18(HPB02_N)* S2_C20(HPB13_P)* S2_C21(HPB13_N)* S2_C23(HPB18_P)* S2_C24(HPB18_N)* S2_C26(HPC17_P)* S2_C27(HPC17_N)* S2_C29(HPC10_CC_P)* S2_C30(HPC10_CC_N)* S2_C32(HPC11_P)* S2_C33(HPC11_N)* S2_C35(HPC12_P)* S2_C36(HPC12_N)* S2_C38(HPC05_CC_P)* S2_C39(HPC05_CC_N)* S2_C41(HPC_CLK0_P)* S2_C42(HPC_CLK0_N)* S2_C46(HDB06)* S2_C47(HDB07)* S2_C48(HDB08_CC)* S2_C50(HDB09)* S2_C51(HDB10)* S2_C52(HDB11)* S2_C54(HDC06)* S2_C55(HDC07)* S2_C56(HDC08_CC)* S2_C58(HDC09)* S2_C59(HDC10)* S2_C60(HDC11)* S2_D12(HPB01_P)* S2_D13(HPB01_N)* S2_D15(HPB00_CC_P)* S2_D16(HPB00_CC_N)* S2_D18(HPB_CLK0_P)* S2_D19(HPB_CLK0_N)* S2_D21(HPB04_P)* S2_D22(HPB04_N)* S2_D24(HPB17_P)* S2_D25(HPB17_N)* S2_D27(HPC09_P)* S2_D28(HPC09_N)* S2_D30(HPC01_P)* S2_D31(HPC01_N)* S2_D33(HPC00_CC_P)* S2_D34(HPC00_CC_N)* S2_D36(HPC02_P)* S2_D37(HPC02_N)* S2_D39(HPC04_P)* S2_D40(HPC04_N)* S2_D44(HDB00_CC)* S2_D45(HDB01)* S2_D46(HDB02)* S2_D48(HDB03)* S2_D49(HDB04)* S2_D50(HDB05)* S2_D52(HDC00_CC)* S2_D53(HDC01)* S2_D54(HDC02)* S2_D56(HDC03)* S2_D57(HDC04)* S2_D58(HDC05)*

### Layout directives
differential pair; differential pair class DIFFPAIR90: GTH_DP0_M2C_N, GTH_DP0_M2C_P, GTH_DP1_C2M_N, GTH_DP1_C2M_P, GTH_DP1_M2C_N, GTH_DP1_M2C_P, GTH_DP3_C2M_N, GTH_DP3_C2M_P
net class DIFFPAIR_GTH: GTH_DP0_M2C_N, GTH_DP0_M2C_P, GTH_DP1_C2M_N, GTH_DP1_C2M_P, GTH_DP1_M2C_N, GTH_DP1_M2C_P, GTH_DP3_C2M_N, GTH_DP3_C2M_P
differential pair: GTH_DP0_M2C_N, GTH_DP0_M2C_P, GTH_DP1_C2M_N, GTH_DP1_C2M_P, GTH_DP1_M2C_N, GTH_DP1_M2C_P, GTH_DP3_C2M_N, GTH_DP3_C2M_P, GTH_REFCLK0_C2M_N, GTH_REFCLK0_C2M_P
net class DIFFPAIR_REFCLK: GTH_REFCLK0_C2M_N, GTH_REFCLK0_C2M_P
differential pair; differential pair class DIFFPAIR100: GTH_REFCLK0_C2M_N, GTH_REFCLK0_C2M_P

### Notes on the sheet
- GTH Tranceivers:
  - Route PCIE Data Lanes as a stripline
  - 90 ohm differential impedance
  - length match to +-0.5mil
  - maximum 2 via transitions
- Engineer
- Date
- Revision
- Sheet Number
- (in symbol KRIA_K26_SOM, part D) SOM2; C & D

### Library data of the parts
C600 C602 C604 = CAP_CL05A104KA5NNNC: as C200 on sheet S02_Power_Converters; Manufacturer Part Number 1: CL05A104KA5NNNC; Case/Package: 0402; Mounting Type: Surface Mount; Temperature Coefficient: X5R
C601 C603 C605 = CAP_CL21A106KAYNNNE: as C203 on sheet S02_Power_Converters; Manufacturer Part Number 1: CL21A106KAYNNNE; Case/Package: 0805; Mounting Type: Surface Mount; Temperature Coefficient: X5R
J300 = KRIA_K26_SOM: as J300 on sheet S03_SOM1_A_B; Manufacturer: Samtec; Manufacturer Part NUmber: REF-226081-01; Number of Rows: 8

## Sheet S07_PCIe_Connector.SchDoc: PCIe Connector
size 381 x 241 mm; SheetNumber: 7; SheetTotal: 12
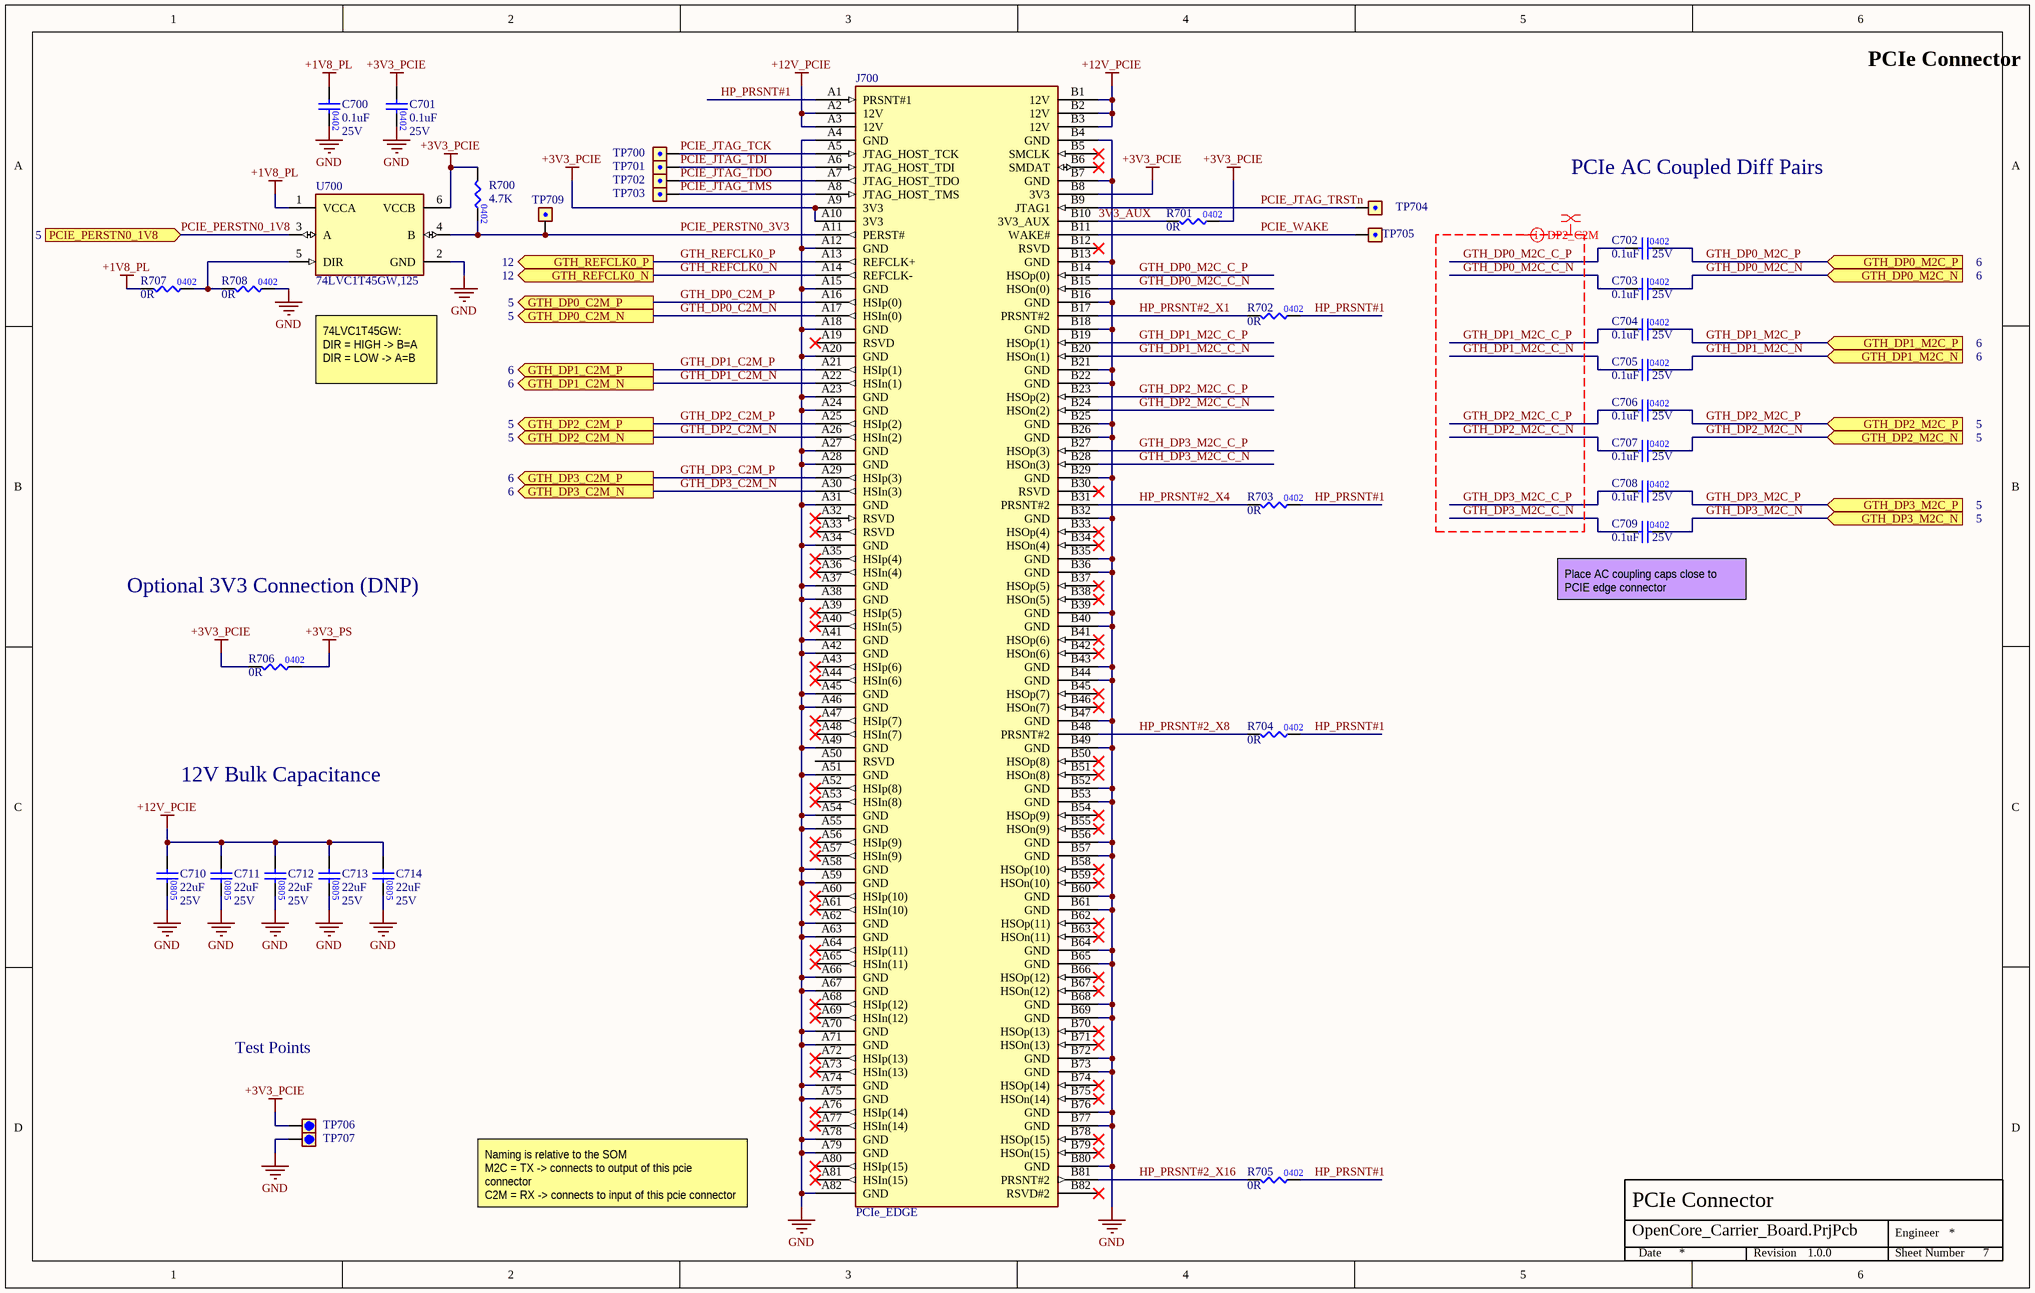
[diagram p6: S07_PCIe_Connector.SchDoc]

### Parts
C700  value 0.1uF  Voltage Rating: 25V  [CAP0402]  (hidden comment: CAP_0402)
C701  value 0.1uF  Voltage Rating: 25V  [CAP0402]  (hidden comment: CAP_0402)
C702  value 0.1uF  Voltage Rating: 25V  [CAP0402]  (hidden comment: CAP_0402)
C703  value 0.1uF  Voltage Rating: 25V  [CAP0402]  (hidden comment: CAP_0402)
C704  value 0.1uF  Voltage Rating: 25V  [CAP0402]  (hidden comment: CAP_0402)
C705  value 0.1uF  Voltage Rating: 25V  [CAP0402]  (hidden comment: CAP_0402)
C706  value 0.1uF  Voltage Rating: 25V  [CAP0402]  (hidden comment: CAP_0402)
C707  value 0.1uF  Voltage Rating: 25V  [CAP0402]  (hidden comment: CAP_0402)
C708  value 0.1uF  Voltage Rating: 25V  [CAP0402]  (hidden comment: CAP_0402)
C709  value 0.1uF  Voltage Rating: 25V  [CAP0402]  (hidden comment: CAP_0402)
C710  value 22uF  Voltage Rating: 25V  [CAP0805]  (hidden comment: CAP_0805)
C711  value 22uF  Voltage Rating: 25V  [CAP0805]  (hidden comment: CAP_0805)
C712  value 22uF  Voltage Rating: 25V  [CAP0805]  (hidden comment: CAP_0805)
C713  value 22uF  Voltage Rating: 25V  [CAP0805]  (hidden comment: CAP_0805)
C714  value 22uF  Voltage Rating: 25V  [CAP0805]  (hidden comment: CAP_0805)
J700  PCIe_EDGE  [PCIe]
R700  Resistance: 4.7K  [RES0402]  (hidden comment: RES_0402)
R701  Resistance: 0R  [RES0402]  (hidden comment: RES_0402)
R702  Resistance: 0R  [RES0402]  (hidden comment: RES_0402)
R703  Resistance: 0R  [RES0402]  (hidden comment: RES_0402)
R704  Resistance: 0R  [RES0402]  (hidden comment: RES_0402)
R705  Resistance: 0R  [RES0402]  (hidden comment: RES_0402)
R706  Resistance: 0R  [RES0402]  (hidden comment: RES_0402)
R707  Resistance: 0R  [RES0402]  (hidden comment: RES_0402)
R708  Resistance: 0R  [RES0402]  (hidden comment: RES_0402)
TP700  1mm Round Pad Testpoint  [TP_1MM]  (value not drawn)
TP701  1mm Round Pad Testpoint  [TP_1MM]  (value not drawn)
TP702  1mm Round Pad Testpoint  [TP_1MM]  (value not drawn)
TP703  1mm Round Pad Testpoint  [TP_1MM]  (value not drawn)
TP704  1mm Round Pad Testpoint  [TP_1MM]  (value not drawn)
TP705  1mm Round Pad Testpoint  [TP_1MM]  (value not drawn)
TP706  2mm Round Pad Testpoint  [TP_2MM]  (value not drawn)
TP707  2mm Round Pad Testpoint  [TP_2MM]  (value not drawn)
TP709  1mm Round Pad Testpoint  [TP_1MM]  (value not drawn)
U700  74LVC1T45GW,125  [NEXPERIA_TSSOP6]

### Ports
GTH_DP0_C2M_N (out, see 5), GTH_DP0_C2M_P (out, see 5), GTH_DP0_M2C_N (in, see 6), GTH_DP0_M2C_P (in, see 6), GTH_DP1_C2M_N (out, see 6), GTH_DP1_C2M_P (out, see 6), GTH_DP1_M2C_N (in, see 6), GTH_DP1_M2C_P (in, see 6), GTH_DP2_C2M_N (out, see 5), GTH_DP2_C2M_P (out, see 5), GTH_DP2_M2C_N (in, see 5), GTH_DP2_M2C_P (in, see 5), GTH_DP3_C2M_N (out, see 6), GTH_DP3_C2M_P (out, see 6), GTH_DP3_M2C_N (in, see 5), GTH_DP3_M2C_P (in, see 5), GTH_REFCLK0_N (out, see 12), GTH_REFCLK0_P (out, see 12), PCIE_PERSTN0_1V8 (in, see 5)

### Nets
+1V8_PL: C700.1 R707.1 U700.1(VCCA)
+3V3_PCIE: C701.1 J700.A9(3V3) J700.A10(3V3) J700.B8(3V3) R700.1 R701.2 R706.1 TP706.1 U700.6(VCCB)
+3V3_PS: R706.2
+12V_PCIE: C710.1 C711.1 C712.1 C713.1 C714.1 J700.A2(12V) J700.A3(12V) J700.B1(12V) J700.B2(12V) J700.B3(12V)
GND: C700.2 C701.2 C710.2 C711.2 C712.2 C713.2 C714.2 J700.A4(GND) J700.A12(GND) J700.A15(GND) J700.A18(GND) J700.A20(GND) J700.A23(GND) J700.A24(GND) J700.A27(GND) J700.A28(GND) J700.A31(GND) J700.A34(GND) J700.A37(GND) J700.A38(GND) J700.A41(GND) J700.A42(GND) J700.A45(GND) J700.A46(GND) J700.A49(GND) J700.A51(GND) J700.A54(GND) J700.A55(GND) J700.A58(GND) J700.A59(GND) J700.A62(GND) J700.A63(GND) J700.A66(GND) J700.A67(GND) J700.A70(GND) J700.A71(GND) J700.A74(GND) J700.A75(GND) J700.A78(GND) J700.A79(GND) J700.A82(GND) J700.B4(GND) J700.B7(GND) J700.B13(GND) J700.B16(GND) J700.B18(GND) J700.B21(GND) J700.B22(GND) J700.B25(GND) J700.B26(GND) J700.B29(GND) J700.B32(GND) J700.B35(GND) J700.B36(GND) J700.B39(GND) J700.B40(GND) J700.B43(GND) J700.B44(GND) J700.B47(GND) J700.B49(GND) J700.B52(GND) J700.B53(GND) J700.B56(GND) J700.B57(GND) J700.B60(GND) J700.B61(GND) J700.B64(GND) J700.B65(GND) J700.B68(GND) J700.B69(GND) J700.B72(GND) J700.B73(GND) J700.B76(GND) J700.B77(GND) J700.B80(GND) R708.2 TP707.1 U700.2(GND)
3V3_AUX: J700.B10(3V3_AUX) R701.1
GTH_DP0_C2M_N: J700.A17(HSIn(0)) ; port GTH_DP0_C2M_N
GTH_DP0_C2M_P: J700.A16(HSIp(0)) ; port GTH_DP0_C2M_P
GTH_DP0_M2C_C_N: C703.1 J700.B15(HSOn(0))
GTH_DP0_M2C_C_P: C702.1 J700.B14(HSOp(0))
GTH_DP0_M2C_N: C703.2 ; port GTH_DP0_M2C_N
GTH_DP0_M2C_P: C702.2 ; port GTH_DP0_M2C_P
GTH_DP1_C2M_N: J700.A22(HSIn(1)) ; port GTH_DP1_C2M_N
GTH_DP1_C2M_P: J700.A21(HSIp(1)) ; port GTH_DP1_C2M_P
GTH_DP1_M2C_C_N: C705.1 J700.B20(HSOn(1))
GTH_DP1_M2C_C_P: C704.1 J700.B19(HSOp(1))
GTH_DP1_M2C_N: C705.2 ; port GTH_DP1_M2C_N
GTH_DP1_M2C_P: C704.2 ; port GTH_DP1_M2C_P
GTH_DP2_C2M_N: J700.A26(HSIn(2)) ; port GTH_DP2_C2M_N
GTH_DP2_C2M_P: J700.A25(HSIp(2)) ; port GTH_DP2_C2M_P
GTH_DP2_M2C_C_N: C707.1 J700.B24(HSOn(2))
GTH_DP2_M2C_C_P: C706.1 J700.B23(HSOp(2))
GTH_DP2_M2C_N: C707.2 ; port GTH_DP2_M2C_N
GTH_DP2_M2C_P: C706.2 ; port GTH_DP2_M2C_P
GTH_DP3_C2M_N: J700.A30(HSIn(3)) ; port GTH_DP3_C2M_N
GTH_DP3_C2M_P: J700.A29(HSIp(3)) ; port GTH_DP3_C2M_P
GTH_DP3_M2C_C_N: C709.1 J700.B28(HSOn(3))
GTH_DP3_M2C_C_P: C708.1 J700.B27(HSOp(3))
GTH_DP3_M2C_N: C709.2 ; port GTH_DP3_M2C_N
GTH_DP3_M2C_P: C708.2 ; port GTH_DP3_M2C_P
GTH_REFCLK0_N: J700.A14(REFCLK-) ; port GTH_REFCLK0_N
GTH_REFCLK0_P: J700.A13(REFCLK+) ; port GTH_REFCLK0_P
HP_PRSNT#1: J700.A1(PRSNT#1) R702.2 R703.2 R704.2 R705.2
HP_PRSNT#2_X1: J700.B17(PRSNT#2) R702.1
HP_PRSNT#2_X4: J700.B31(PRSNT#2) R703.1
HP_PRSNT#2_X8: J700.B48(PRSNT#2) R704.1
HP_PRSNT#2_X16: J700.B81(PRSNT#2) R705.1
PCIE_JTAG_TCK: J700.A5(JTAG_HOST_TCK) TP700.1
PCIE_JTAG_TDI: J700.A6(JTAG_HOST_TDI) TP701.1
PCIE_JTAG_TDO: J700.A7(JTAG_HOST_TDO) TP702.1
PCIE_JTAG_TMS: J700.A8(JTAG_HOST_TMS) TP703.1
PCIE_JTAG_TRSTn: J700.B9(JTAG1) TP704.1
PCIE_PERSTN0_1V8: U700.3(A) ; port PCIE_PERSTN0_1V8
PCIE_PERSTN0_3V3: J700.A11(PERST#) R700.2 TP709.1 U700.4(B)
PCIE_WAKE: J700.B11(WAKE#) TP705.1
NetR707_2: R707.2 R708.1 U700.5(DIR)

Not connected (* = marked no-connect by the designer): J700 A19(RSVD)* A32(RSVD)* A33(RSVD)* A35(HSIp(4))* A36(HSIn(4))* A39(HSIp(5))* A40(HSIn(5))* A43(HSIp(6))* A44(HSIn(6))* A47(HSIp(7))* A48(HSIn(7))* A50(RSVD) A52(HSIp(8))* A53(HSIn(8))* A56(HSIp(9))* A57(HSIn(9))* A60(HSIp(10))* A61(HSIn(10))* A64(HSIp(11))* A65(HSIn(11))* A68(HSIp(12))* A69(HSIn(12))* A72(HSIp(13))* A73(HSIn(13))* A76(HSIp(14))* A77(HSIn(14))* A80(HSIp(15))* A81(HSIn(15))* B5(SMCLK)* B6(SMDAT)* B12(RSVD)* B30(RSVD)* B33(HSOp(4))* B34(HSOn(4))* B37(HSOp(5))* B38(HSOn(5))* B41(HSOp(6))* B42(HSOn(6))* B45(HSOp(7))* B46(HSOn(7))* B50(HSOp(8))* B51(HSOn(8))* B54(HSOp(9))* B55(HSOn(9))* B58(HSOp(10))* B59(HSOn(10))* B62(HSOp(11))* B63(HSOn(11))* B66(HSOp(12))* B67(HSOn(12))* B70(HSOp(13))* B71(HSOn(13))* B74(HSOp(14))* B75(HSOn(14))* B78(HSOp(15))* B79(HSOn(15))* B82(RSVD#2)*

### Layout directives
differential pair; differential pair class DIFFPAIR90: GTH_DP0_M2C_C_N, GTH_DP0_M2C_C_P, GTH_DP1_M2C_C_N, GTH_DP1_M2C_C_P, GTH_DP2_M2C_C_N, GTH_DP2_M2C_C_P, GTH_DP3_M2C_C_N, GTH_DP3_M2C_C_P
net class DIFFPAIR_GTH: GTH_DP0_M2C_C_N, GTH_DP0_M2C_C_P, GTH_DP1_M2C_C_N, GTH_DP1_M2C_C_P, GTH_DP2_M2C_C_N, GTH_DP2_M2C_C_P, GTH_DP3_M2C_C_N, GTH_DP3_M2C_C_P

### Notes on the sheet
- PCIe AC Coupled Diff Pairs
- 74LVC1T45GW:
  DIR = HIGH -> B=A
  DIR = LOW -> A=B
- Optional 3V3 Connection (DNP)
- (near C709) Place AC coupling caps close to PCIE edge connector
- 12V Bulk Capacitance
- Test Points
- Naming is relative to the SOM
  M2C = TX -> connects to output of this pcie connector
  C2M = RX -> connects to input of this pcie connector
- Engineer
- Date
- Revision
- Sheet Number

### Library data of the parts
C700-C709 = CAP_CL05A104KA5NNNC: as C200 on sheet S02_Power_Converters; Manufacturer Part Number 1: CL05A104KA5NNNC; Case/Package: 0402; Mounting Type: Surface Mount; Temperature Coefficient: X5R
C710-C714 = CAP_CL21A226MAYNNNE: as C202 on sheet S02_Power_Converters; Manufacturer Part Number 1: CL21A226MAYNNNE; Case/Package: 0805; Mounting Type: Surface Mount; Temperature Coefficient: X5R
J700 = PCIe_EDGE: PCIe 3.3V x16
R700 = .RES_RC0402FR-074K7L: as R305 on sheet S03_SOM1_A_B; Manufacturer Part Number: RC0402FR-074K7L; Case/Package: 0402; Tolerance: 1%
R701-R708 = .RES_RC0402JR-070RL: as R201 on sheet S02_Power_Converters; Manufacturer Part Number: RC0402JR-070RL; Case/Package: 0402
TP700-TP705 TP709 = TP_1MM
TP706 TP707 = TP_2MM
U700 = 74LVC1T45GW,125: IC TRANSLTR BIDIRECTIONAL 6TSSOP